# EAGLE design BatteryBalancer_SP20 (EAGLE 9.5.2)

## Sheet 1 of 5: Connectors
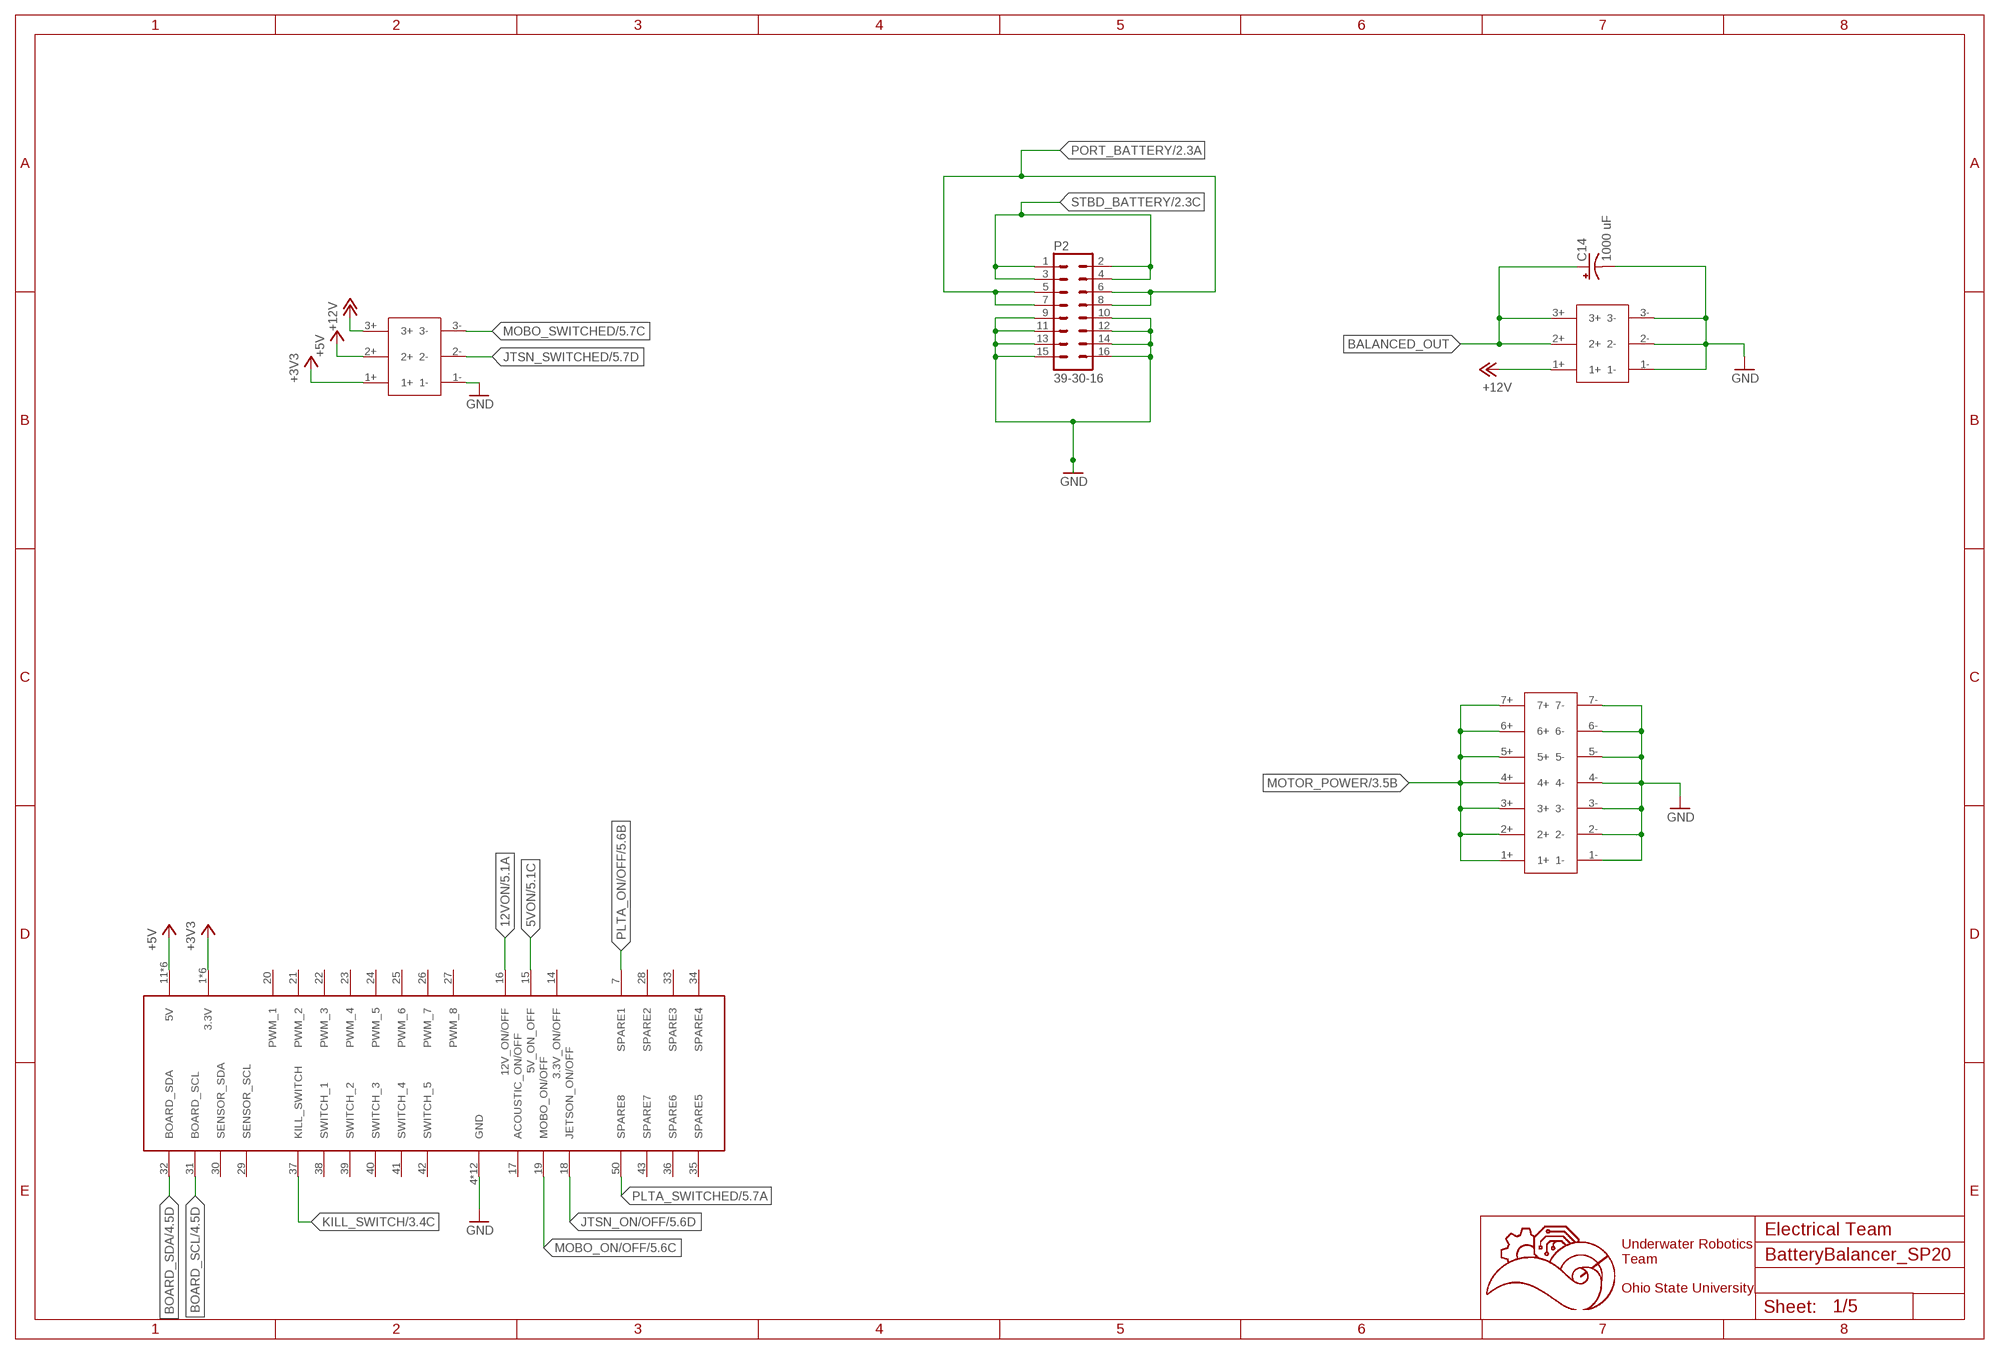
[diagram p0: schematic, sheet 1]

### Parts
C14  1000 uF  CPOL-USE5-13  [E5-13]
P2  39-30-16  [39-30-?16?]
U$1  5530843-EDGE  [5530843-6-BOARDFINGERS]
U$4  14PIN-VERT  [14PIN_VERT]
U$5  6PIN-VERT  [6PIN_VERT]
U$13  6PIN-VERT  [6PIN_VERT]

### Nets
5VON: U$1.15(5V_ON_OFF) ; also sheet 5
12VON: U$1.16(12V_ON/OFF) ; also sheet 5
+3V3: U$1.1(3.3V) U$1.2(3.3V) U$1.3(3.3V) U$1.54(3.3V) U$1.55(3.3V) U$1.56(3.3V) U$5.1+ ; also sheet 2,3,4,5
+5V: U$1.11(5V) U$1.12(5V) U$1.13(5V) U$1.44(5V) U$1.45(5V) U$1.46(5V) U$5.2+ ; also sheet 4,5
+12V: U$5.3+ U$13.1+ ; also sheet 4,5
BALANCED_OUT: C14.+ U$13.2+ U$13.3+ ; also sheet 2,3,4,5
BOARD_SCL: U$1.31(BOARD_SCL) ; also sheet 4
BOARD_SDA: U$1.32(BOARD_SDA) ; also sheet 4
GND: C14.- P2.9 P2.10 P2.11 P2.12 P2.13 P2.14 P2.15 P2.16 U$1.4(GND) U$1.5(GND) U$1.6(GND) U$1.8(GND) U$1.9(GND) U$1.10(GND) U$1.47(GND) U$1.48(GND) U$1.49(GND) U$1.51(GND) U$1.52(GND) U$1.53(GND) U$4.1- U$4.2- U$4.3- U$4.4- U$4.5- U$4.6- U$4.7- U$5.1- U$13.1- U$13.2- U$13.3- ; also sheet 2,4,5
JTSN_ON/OFF: U$1.18(JETSON_ON/OFF) ; also sheet 5
JTSN_SWITCHED: U$5.2- ; also sheet 5
KILL_SWITCH: U$1.37(KILL_SWITCH) ; also sheet 3
MOBO_ON/OFF: U$1.19(MOBO_ON/OFF) ; also sheet 5
MOBO_SWITCHED: U$5.3- ; also sheet 5
MOTOR_POWER: U$4.1+ U$4.2+ U$4.3+ U$4.4+ U$4.5+ U$4.6+ U$4.7+ ; also sheet 3
PLTA_ON/OFF: U$1.7(SPARE1) ; also sheet 5
PLTA_SWITCHED: U$1.50(SPARE8) ; also sheet 5
PORT_BATTERY: P2.5 P2.6 P2.7 P2.8 ; also sheet 2,4
STBD_BATTERY: P2.1 P2.2 P2.3 P2.4 ; also sheet 2,4
Unconnected: U$1.14(3.3V_ON/OFF) U$1.17(ACOUSTIC_ON/OFF) U$1.20(PWM_1) U$1.21(PWM_2) U$1.22(PWM_3) U$1.23(PWM_4) U$1.24(PWM_5) U$1.25(PWM_6) U$1.26(PWM_7) U$1.27(PWM_8) U$1.28(SPARE2) U$1.29(SENSOR_SCL) U$1.30(SENSOR_SDA) U$1.33(SPARE3) U$1.34(SPARE4) U$1.35(SPARE5) U$1.36(SPARE6) U$1.38(SWITCH_1) U$1.39(SWITCH_2) U$1.40(SWITCH_3) U$1.41(SWITCH_4) U$1.42(SWITCH_5) U$1.43(SPARE7)

### Notes on the sheet
- Electrical Team
- Underwater Robotics
  Team
  
  Ohio State University

## Sheet 2 of 5
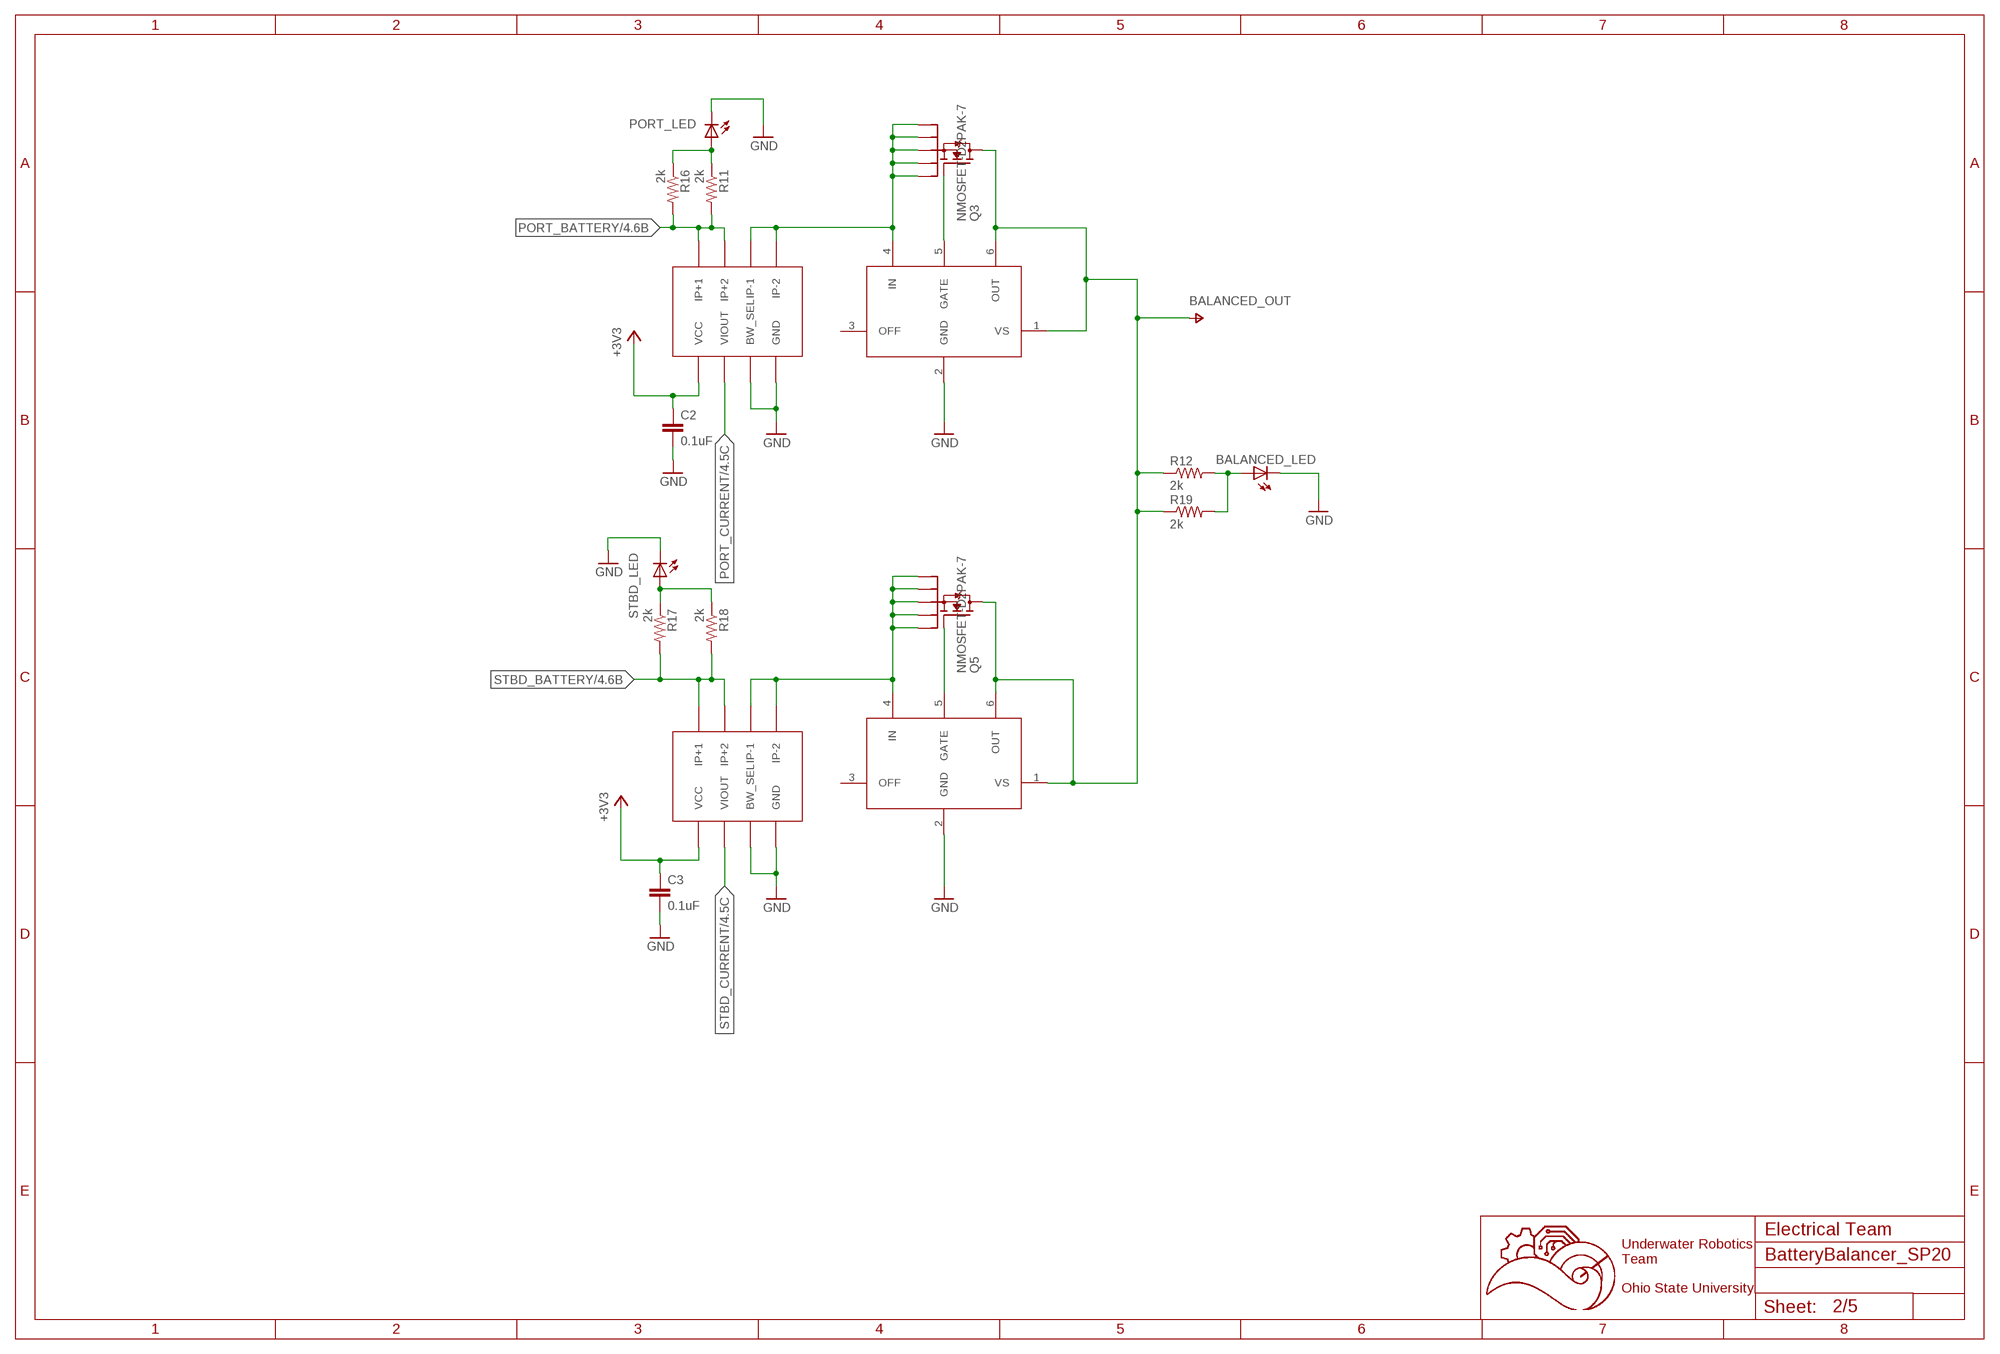
[diagram p1: schematic, sheet 2]

### Parts
BALANCED_LED  LEDCHIP-LED0603  [CHIP-LED0603]
C2  0.1uF  C-EUC0603  [C0603]
C3  0.1uF  C-EUC0603  [C0603]
PORT_LED  LEDCHIP-LED0603  [CHIP-LED0603]
Q3  NMOSFET-D2PAK-7  [D2PAK-7]
Q5  NMOSFET-D2PAK-7  [D2PAK-7]
R11  2k  R-US_R0603  [R0603]
R12  2k  R-US_R0603  [R0603]
R16  2k  R-US_R0603  [R0603]
R17  2k  R-US_R0603  [R0603]
R18  2k  R-US_R0603  [R0603]
R19  2k  R-US_R0603  [R0603]
STBD_LED  LEDCHIP-LED0603  [CHIP-LED0603]
U$2  LM5050  [LM5050]
U$3  LM5050  [LM5050]
U$6  ACS722  [SOIC-8]
U$7  ACS722  [SOIC-8]

### Nets
+3V3: C2.1 C3.1 U$6.VCC U$7.VCC ; also sheet 1,3,4,5
BALANCED_OUT: Q3.D Q5.D R12.1 R19.1 U$2.1(VS) U$2.6(OUT) U$3.1(VS) U$3.6(OUT) ; supply symbol labelled V+ ; also sheet 1,3,4,5
GND: BALANCED_LED.C C2.2 C3.2 PORT_LED.C STBD_LED.C U$2.2(GND) U$3.2(GND) U$6.BW_SEL U$6.GND U$7.BW_SEL U$7.GND ; also sheet 1,4,5
N$1: Q3.S1 Q3.S2 Q3.S3 Q3.S4 Q3.S5 U$2.4(IN) U$6.IP-1 U$6.IP-2
N$2: Q3.G U$2.5(GATE)
N$5: Q5.G U$3.5(GATE)
N$11: PORT_LED.A R11.1 R16.1
N$12: R17.1 R18.1 STBD_LED.A
N$13: BALANCED_LED.A R12.2 R19.2
PORT_BATTERY: R11.2 R16.2 U$6.IP+1 U$6.IP+2 ; also sheet 1,4
PORT_CURRENT: U$6.VIOUT ; also sheet 4
SOURCE: Q5.S1 Q5.S2 Q5.S3 Q5.S4 Q5.S5 U$3.4(IN) U$7.IP-1 U$7.IP-2
STBD_BATTERY: R17.2 R18.2 U$7.IP+1 U$7.IP+2 ; also sheet 1,4
STBD_CURRENT: U$7.VIOUT ; also sheet 4
Unconnected: U$2.3(OFF) U$3.3(OFF)

### Notes on the sheet
- Electrical Team
- Underwater Robotics
  Team
  
  Ohio State University

## Sheet 3 of 5
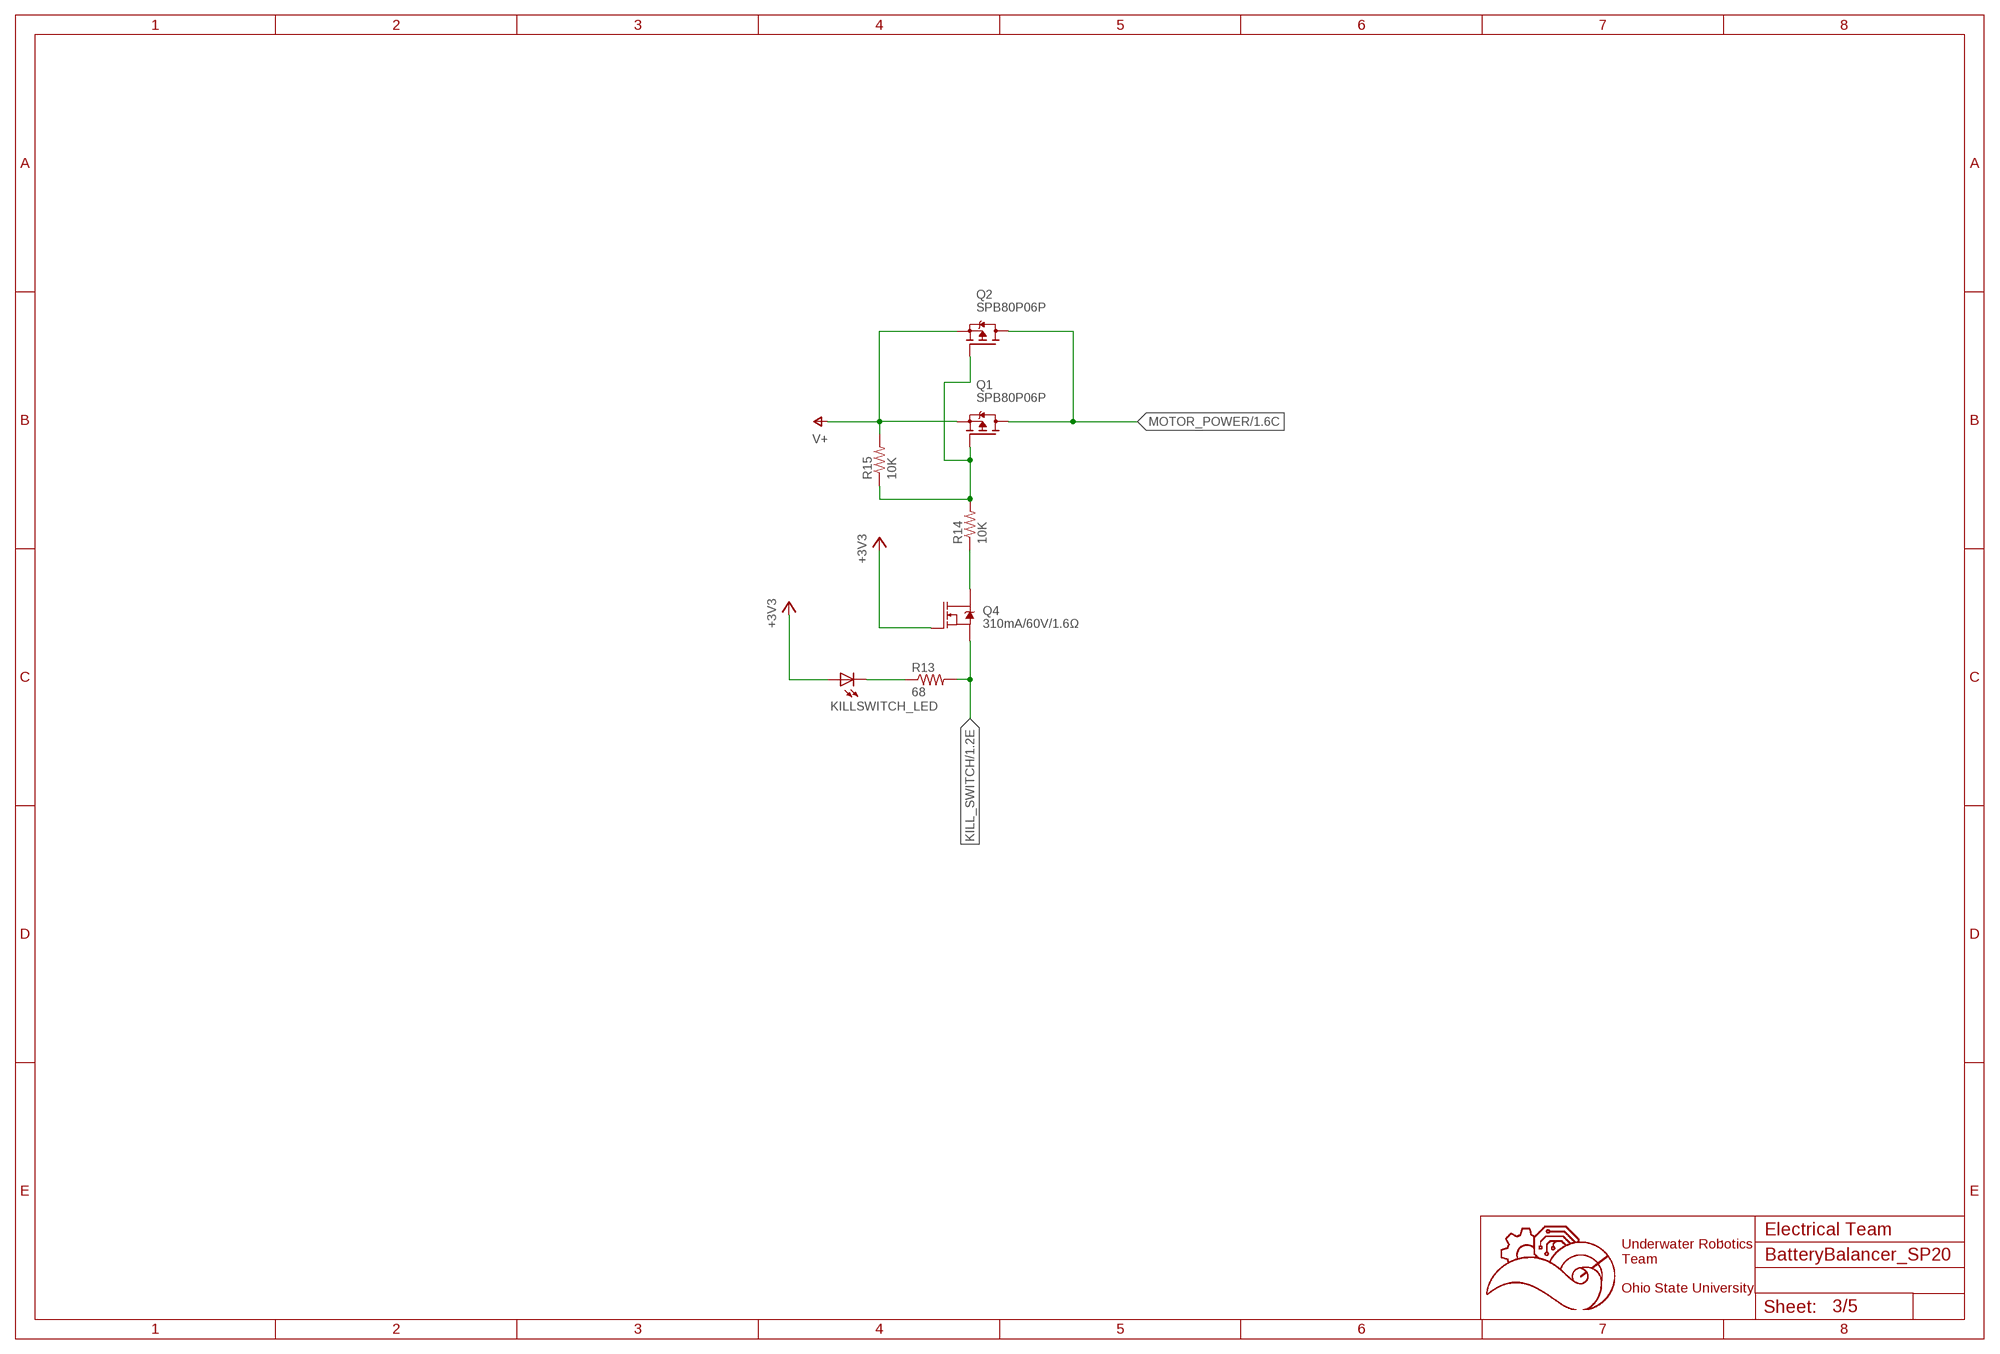
[diagram p2: schematic, sheet 3]

### Parts
KILLSWITCH_LED  LEDCHIP-LED0603  [CHIP-LED0603]
Q1  SPB80P06P  [TO263]
Q2  SPB80P06P  [TO263]
Q4  310mA/60V/1.6Ω  MOSFET-NCH-2N7002PW  [SOT323]
R13  68  R-US_R0603  [R0603]
R14  10K  R-US_R0603  [R0603]
R15  10K  R-US_R0603  [R0603]

### Nets
+3V3: KILLSWITCH_LED.A Q4.1(G) ; also sheet 1,2,4,5
BALANCED_OUT: Q1.2(S) Q2.2(S) R15.2 ; supply symbol labelled V+ ; also sheet 1,2,4,5
KILL_SWITCH: Q4.2(S) R13.2 ; also sheet 1
MOTOR_POWER: Q1.3(D) Q2.3(D) ; also sheet 1
N$4: Q4.3(D) R14.1
N$8: Q1.1(G) Q2.1(G) R14.2 R15.1
N$16: KILLSWITCH_LED.C R13.1

### Notes on the sheet
- Electrical Team
- Underwater Robotics
  Team
  
  Ohio State University

## Sheet 4 of 5
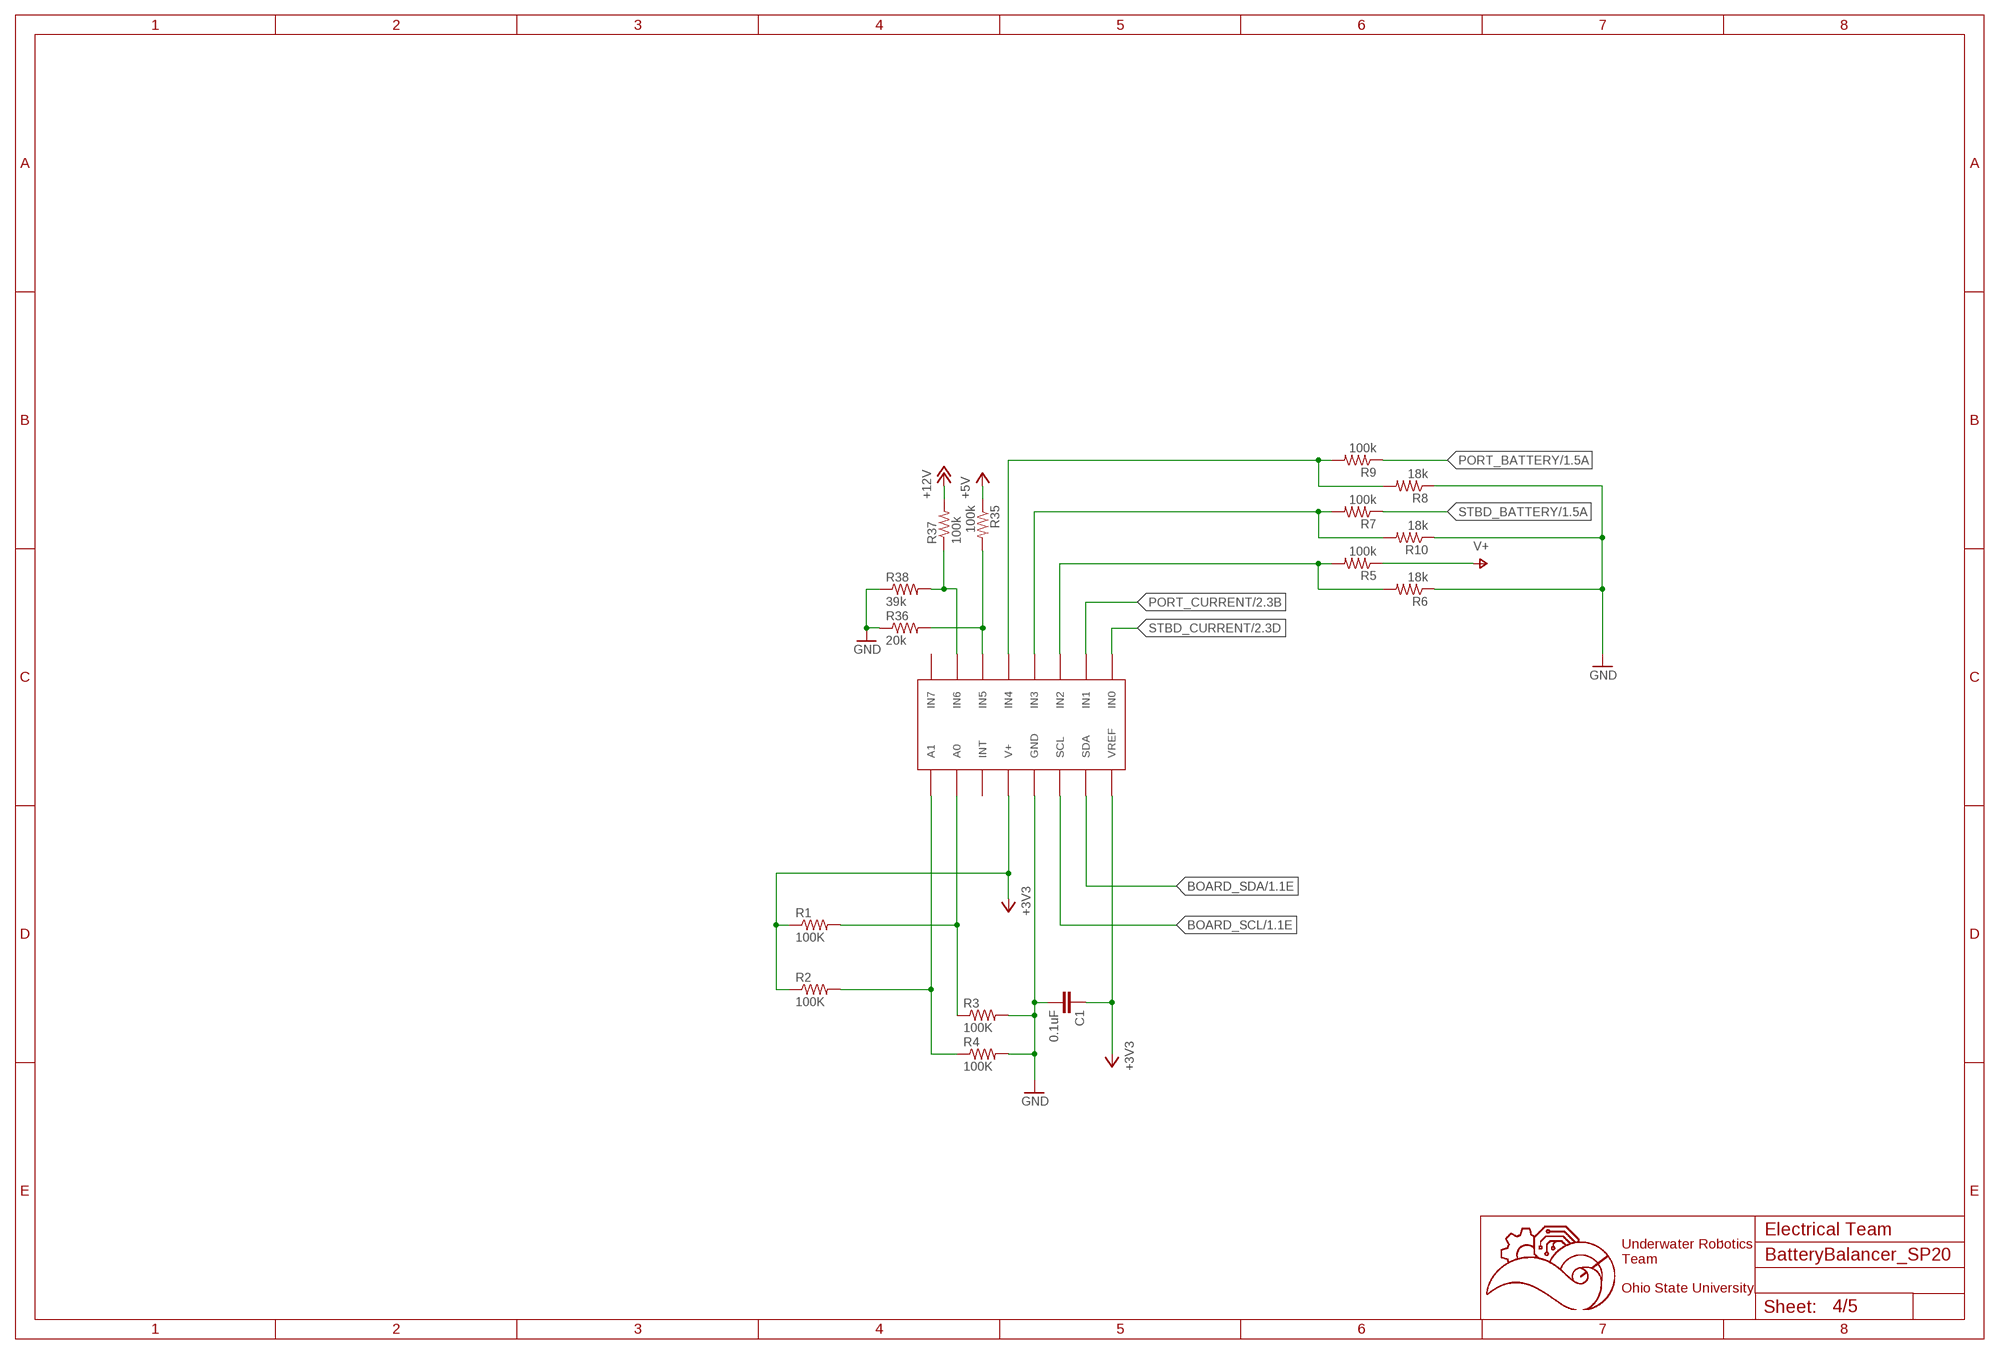
[diagram p3: schematic, sheet 4]

### Parts
C1  0.1uF  C-EUC0603  [C0603]
R1  100K  R-US_R0603  [R0603]
R2  100K  R-US_R0603  [R0603]
R3  100K  R-US_R0603  [R0603]
R4  100K  R-US_R0603  [R0603]
R5  100k  R-US_R0603  [R0603]
R6  18k  R-US_R0603  [R0603]
R7  100k  R-US_R0603  [R0603]
R8  18k  R-US_R0603  [R0603]
R9  100k  R-US_R0603  [R0603]
R10  18k  R-US_R0603  [R0603]
R35  100k  R-US_R0603  [R0603]
R36  20k  R-US_R0603  [R0603]
R37  100k  R-US_R0603  [R0603]
R38  39k  R-US_R0603  [R0603]
U$12  ADC128D818  [TSSOP-16]

### Nets
+3V3: C1.1 R1.1 R2.1 U$12.V+ U$12.VREF ; also sheet 1,2,3,5
+5V: R35.1 ; also sheet 1,5
+12V: R37.2 ; also sheet 1,5
BALANCED_OUT: R5.1 ; supply symbol labelled V+ ; also sheet 1,2,3,5
BOARD_SCL: U$12.SCL ; also sheet 1
BOARD_SDA: U$12.SDA ; also sheet 1
GND: C1.2 R3.2 R4.2 R6.1 R8.1 R10.1 R36.1 R38.1 U$12.GND ; also sheet 1,2,5
N$6: R2.2 R4.1 U$12.A1
N$7: R1.2 R3.1 U$12.A0
N$9: R7.2 R10.2 U$12.IN3
N$10: R8.2 R9.2 U$12.IN4
N$15: R5.2 R6.2 U$12.IN2
N$31: R37.1 R38.2 U$12.IN6
N$32: R35.2 R36.2 U$12.IN5
PORT_BATTERY: R9.1 ; also sheet 1,2
PORT_CURRENT: U$12.IN1 ; also sheet 2
STBD_BATTERY: R7.1 ; also sheet 1,2
STBD_CURRENT: U$12.IN0 ; also sheet 2
Unconnected: U$12.IN7 U$12.INT

### Notes on the sheet
- Electrical Team
- Underwater Robotics
  Team
  
  Ohio State University

## Sheet 5 of 5
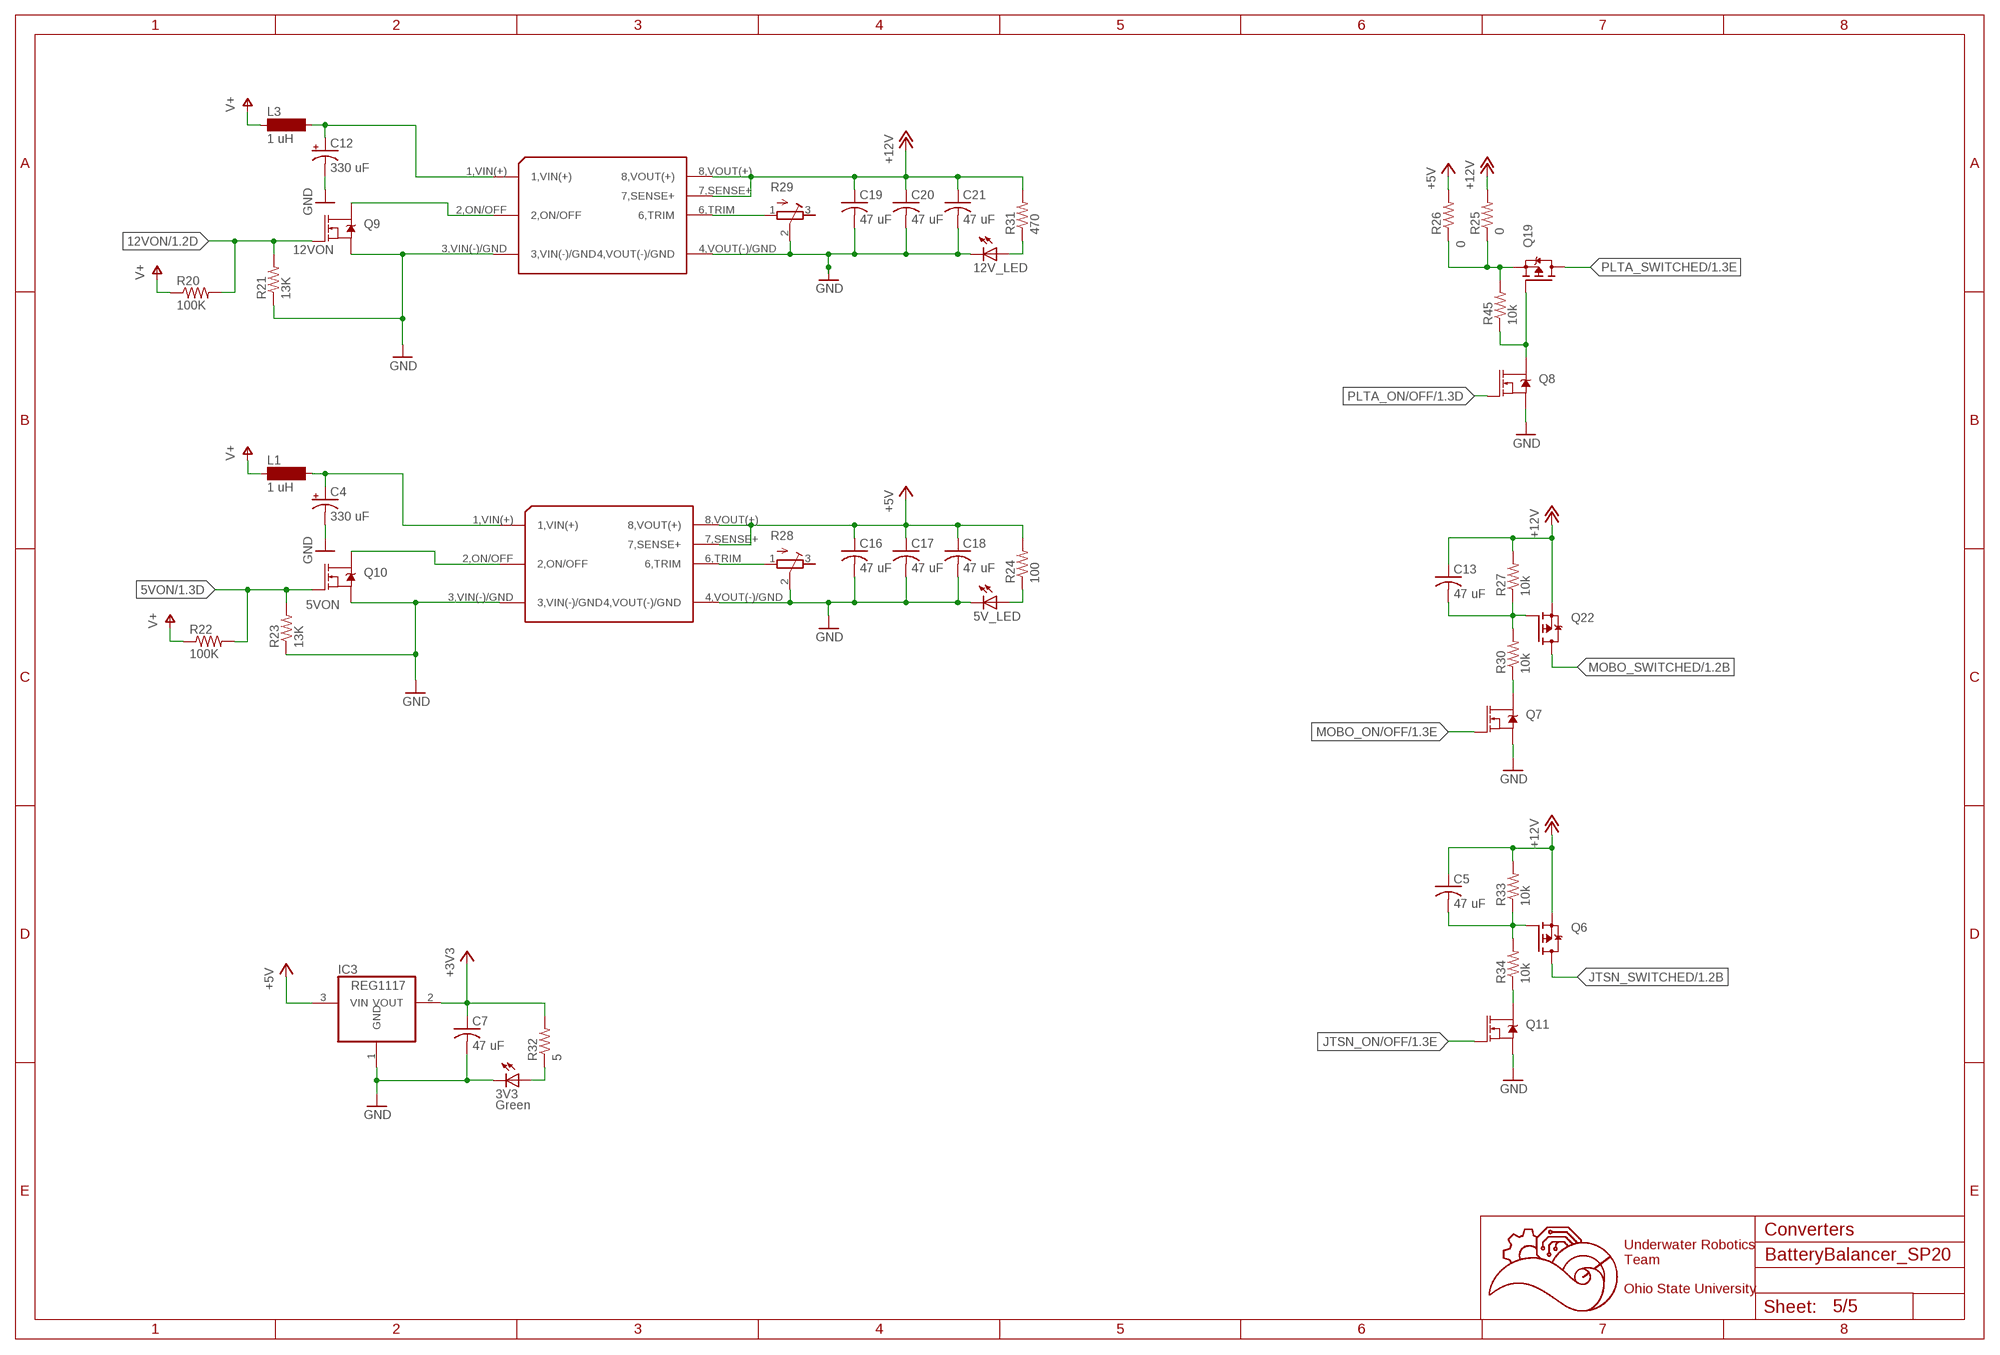
[diagram p4: schematic, sheet 5]

### Parts
3V3  Green  LEDCHIPLED_0603  [CHIPLED_0603]
5V_LED  LEDCHIPLED_0603  [CHIPLED_0603]
5VCONVERTER  CONVERTER  [CONVERTER]
12V_LED  LEDCHIPLED_0603  [CHIPLED_0603]
12VCONVERTER  CONVERTER  [CONVERTER]
C4  330 uF  CPOL-USE5-10.5  [E5-10,5]
C5  47 uF  C-USC1206K  [C1206K]
C7  47 uF  C-USC1206K  [C1206K]
C12  330 uF  CPOL-USE5-10.5  [E5-10,5]
C13  47 uF  C-USC1206K  [C1206K]
C16  47 uF  C-USC1206K  [C1206K]
C17  47 uF  C-USC1206K  [C1206K]
C18  47 uF  C-USC1206K  [C1206K]
C19  47 uF  C-USC1206K  [C1206K]
C20  47 uF  C-USC1206K  [C1206K]
C21  47 uF  C-USC1206K  [C1206K]
IC3  REG1117  [SOT223]
L1  1 uH  MS85  [MS85]
L3  1 uH  MS85  [MS85]
Q6  FDD4141TO252  [TO252]
Q7  MOSFET-NCH-AO3404A  [SOT23-3]
Q8  MOSFET-NCH-AO3404A  [SOT23-3]
Q9  MOSFET-NCH-AO3404A  [SOT23-3]
Q10  MOSFET-NCH-AO3404A  [SOT23-3]
Q11  MOSFET-NCH-AO3404A  [SOT23-3]
Q19  FDD4141TO252  [TO252]
Q22  FDD4141TO252  [TO252]
R20  100K  R-US_R0603  [R0603]
R21  13K  R-US_R0603  [R0603]
R22  100K  R-US_R0603  [R0603]
R23  13K  R-US_R0603  [R0603]
R24  100  R-US_R0603  [R0603]
R25  0  R-US_M2309  [M2309]
R26  0  R-US_M2309  [M2309]
R27  10k  R-US_R0603  [R0603]
R28  R-TRIMM3103  [RTRIM3103]
R29  R-TRIMM3103  [RTRIM3103]
R30  10k  R-US_R0603  [R0603]
R31  470  R-US_R0603  [R0603]
R32  5  R-US_R0603  [R0603]
R33  10k  R-US_R0603  [R0603]
R34  10k  R-US_R0603  [R0603]
R45  10k  R-US_R0603  [R0603]

### Nets
5VON: Q10.1(G) R22.2 R23.2 ; also sheet 1
12VON: Q9.1(G) R20.2 R21.2 ; also sheet 1
+3V3: C7.1 IC3.2(VOUT) R32.2 ; also sheet 1,2,3,4
+5V: 5VCONVERTER.7,SENSE+ 5VCONVERTER.8,VOUT(+) C16.1 C17.1 C18.1 IC3.3(VIN) R24.2 R26.2 ; also sheet 1,4
+12V: 12VCONVERTER.7,SENSE+ 12VCONVERTER.8,VOUT(+) C5.1 C13.1 C19.1 C20.1 C21.1 Q6.2(S) Q22.2(S) R25.2 R27.2 R31.2 R33.2 ; also sheet 1,4
BALANCED_OUT: L1.1 L3.1 R20.1 R22.1 ; supply symbol labelled V+ ; also sheet 1,2,3,4
GND: 3V3.C 5V_LED.C 5VCONVERTER.3,VIN(-)/GND 5VCONVERTER.4,VOUT(-)/GND 12V_LED.C 12VCONVERTER.3,VIN(-)/GND 12VCONVERTER.4,VOUT(-)/GND C4.- C7.2 C12.- C16.2 C17.2 C18.2 C19.2 C20.2 C21.2 IC3.1(GND) Q7.2(S) Q8.2(S) Q9.2(S) Q10.2(S) Q11.2(S) R21.1 R23.1 R28.2(S) R29.2(S) ; also sheet 1,2,4
JTSN_ON/OFF: Q11.1(G) ; also sheet 1
JTSN_SWITCHED: Q6.3(D) ; also sheet 1
MOBO_ON/OFF: Q7.1(G) ; also sheet 1
MOBO_SWITCHED: Q22.3(D) ; also sheet 1
N$3: 12VCONVERTER.6,TRIM R29.1(A)
N$14: 5VCONVERTER.6,TRIM R28.1(A)
N$17: C13.2 Q22.1(G) R27.1 R30.2
N$18: 12VCONVERTER.2,ON/OFF Q9.3(D)
N$19: 5VCONVERTER.2,ON/OFF Q10.3(D)
N$20: Q7.3(D) R30.1
N$21: Q19.2(S) R25.1 R26.1 R45.2
N$22: Q8.3(D) Q19.1(G) R45.1
N$23: 12VCONVERTER.1,VIN(+) C12.+ L3.2
N$24: 5VCONVERTER.1,VIN(+) C4.+ L1.2
N$25: 5V_LED.A R24.1
N$26: C5.2 Q6.1(G) R33.1 R34.2
N$27: 12V_LED.A R31.1
N$28: 3V3.A R32.1
N$29: Q11.3(D) R34.1
PLTA_ON/OFF: Q8.1(G) ; also sheet 1
PLTA_SWITCHED: Q19.3(D) ; also sheet 1
Unconnected: R28.3(E) R29.3(E)

### Notes on the sheet
- Converters
- Underwater Robotics
  Team
  
  Ohio State University
- C:/Users/blain/Downloads/Black and White.bmp

## Library data of the parts
3V3 5V_LED 12V_LED BALANCED_LED KILLSWITCH_LED PORT_LED STBD_LED = led:LED: LED OSRAM: - CHIPLED LG R971, LG N971, LY N971, LG Q971, LY Q971, LO R971, LY R971 LH N974, LH R974 LS Q976, LO Q976, LY Q976 LO Q996 - Hyper CHIPLED LW Q18S LB Q993, LB Q99A, LB R99A - SideLED LS A670, LO A670, LY A670, LG A670, LP A670 LB A673, LV A673, LT A673, LW A673 LH A674 LY A675 LS A676, LA A676, LO A676, LY A676, LW A676 LS A679, LY A679, LG A679 - Hyper Micro SIDELED® LS Y876, LA Y876, LO Y876, LY Y876 LT Y87S - SmartLED LW L88C, LW L88S LB L89C, LB L89S, LG L890 LS L89K, LO L89K, LY L89K LS L896, LA L896, LO L896, LY L896 - TOPLED LS T670, LO T670, LY T670, LG T670, LP T670 LSG T670, LSP T670, LSY T670, LOP T670, LYG T670 LG T671, LOG T671, LSG T671 LB T673, LV T673, LT T673, LW T673 LH T674 LS T676, LA T676, LO T676, LY T676, LB T676, LH T676, LSB T676, LW T676 LB T67C, LV T67C, LT T67C, LS T67K, LO T67K, LY T67K, LW E67C LS E67B, LA E67B, LO E67B, LY E67B, LB E67C, LV E67C, LT E67C LW T67C LS T679, LY T679, LG T679 LS T770, LO T770, LY T770, LG T770, LP T770 LB T773, LV T773, LT T773, LW T773 LH T774 LS E675, LA E675, LY E675, LS T675 LS T776, LA T776, LO T776, LY T776, LB T776 LHGB T686 LT T68C, LB T68C - Hyper Mini TOPLED® LB M676 - Mini TOPLED Santana® LG M470 LS M47K, LO M47K, LY M47K Source: http://www.osram.convergy.de LUXEON: - LUMILED® LXK2-PW12-R00, LXK2-PW12-S00, LXK2-PW14-U00, LXK2-PW14-V00 LXK2-PM12-R00, LXK2-PM12-S00, LXK2-PM14-U00 LXK2-PE12-Q00, LXK2-PE12-R00, LXK2-PE12-S00, LXK2-PE14-T00, LXK2-PE14-U00 LXK2-PB12-K00, LXK2-PB12-L00, LXK2-PB12-M00, LXK2-PB14-N00, LXK2-PB14-P00, LXK2-PB14-Q00 LXK2-PR12-L00, LXK2-PR12-M00, LXK2-PR14-Q00, LXK2-PR14-R00 LXK2-PD12-Q00, LXK2-PD12-R00, LXK2-PD12-S00 LXK2-PH12-R00, LXK2-PH12-S00 LXK2-PL12-P00, LXK2-PL12-Q00, LXK2-PL12-R00 Source: www.luxeon.com KINGBRIGHT: KA-3528ASYC Source: www.kingbright.com
5VCONVERTER 12VCONVERTER = converter:CONVERTER
C1-C3 = rcl:C-EU: CAPACITOR, European symbol; SPICEPREFIX: C
C4 C12 C14 = rcl:CPOL-US: POLARIZED CAPACITOR, American symbol; SPICEPREFIX: C
C5 C7 C13 C16-C21 = resistor:C-US: CAPACITOR, American symbol
IC3 = burr-brown:REG1117: 800mA and 1A Low Dropout (LDO) Positive Regulator 1.8V, 2.5V, 2.85V, 3.3V, 5V, and Adj; MPN: REG1117; OC_FARNELL: 1097566; OC_NEWARK: 14P6981
L1 L3 = inductor-neosid:MS85: INDUCTOR SMD power inductor; OC_FARNELL: unknown; OC_NEWARK: unknown
P2 = con-molex-mini-fit:39-30-?16?: HEADER
Q1 Q2 = transistor-fet:SPB80P06P: SIPMOS (R) Power-Transistor P-Channel, Enhancement mode Source: http://www.infineon.com/upload/Document/cmc_upload/documents/011/3685/SPP80P06P.pdf
Q3 Q5 = D2PAK-7:NMOSFET-D2PAK-7
Q4 = SparkFun-DiscreteSemi:MOSFET-NCH: N-channel MOSFETs Voltage controlled devices that allow control of high current outputs. SparkFun Products: SparkFun OpenScale <https://www.sparkfun.com/products/13261> SparkFun Digital Sandbox <https://www.sparkfun.com/products/12651> SparkFun Monster Moto Shield <https://www.sparkfun.com/products/10182> SparkFun MOSFET Power Controller <https://www.sparkfun.com/products/11214>; PROD_ID: TRANS-11151
Q6 Q19 Q22 = transistor-fet:FDD4141: P-Channel PowerTrench® MOSFET Source: FDD4141.pdf
Q7-Q11 = SparkFun-DiscreteSemi:MOSFET-NCH: N-channel MOSFETs Voltage controlled devices that allow control of high current outputs. SparkFun Products: SparkFun OpenScale <https://www.sparkfun.com/products/13261> SparkFun Digital Sandbox <https://www.sparkfun.com/products/12651> SparkFun Monster Moto Shield <https://www.sparkfun.com/products/10182> SparkFun MOSFET Power Controller <https://www.sparkfun.com/products/11214>; PROD_ID: TRANS-12988; VALUE: 5.8A/30V/35mΩ
R1-R24 R31 R32 R35-R38 = rcl:R-US_: RESISTOR, American symbol; SPICEPREFIX: R
R25-R27 R30 R33 R34 R45 = resistor:R-US_: RESISTOR, American symbol
R28 R29 = rcl:R-TRIMM: Trimm resistor; SPICEMODEL: X; SPICEPREFIXL: POT
U$1 = 5530843-6:5530843-EDGE
U$2 U$3 = LM5050:LM5050
U$4 = Vertical_Connectors:14PIN-VERT
U$5 U$13 = Vertical_Connectors:6PIN-VERT
U$6 U$7 = ACS722:ACS722
U$12 = ADC128D818:ADC128D818

## Board
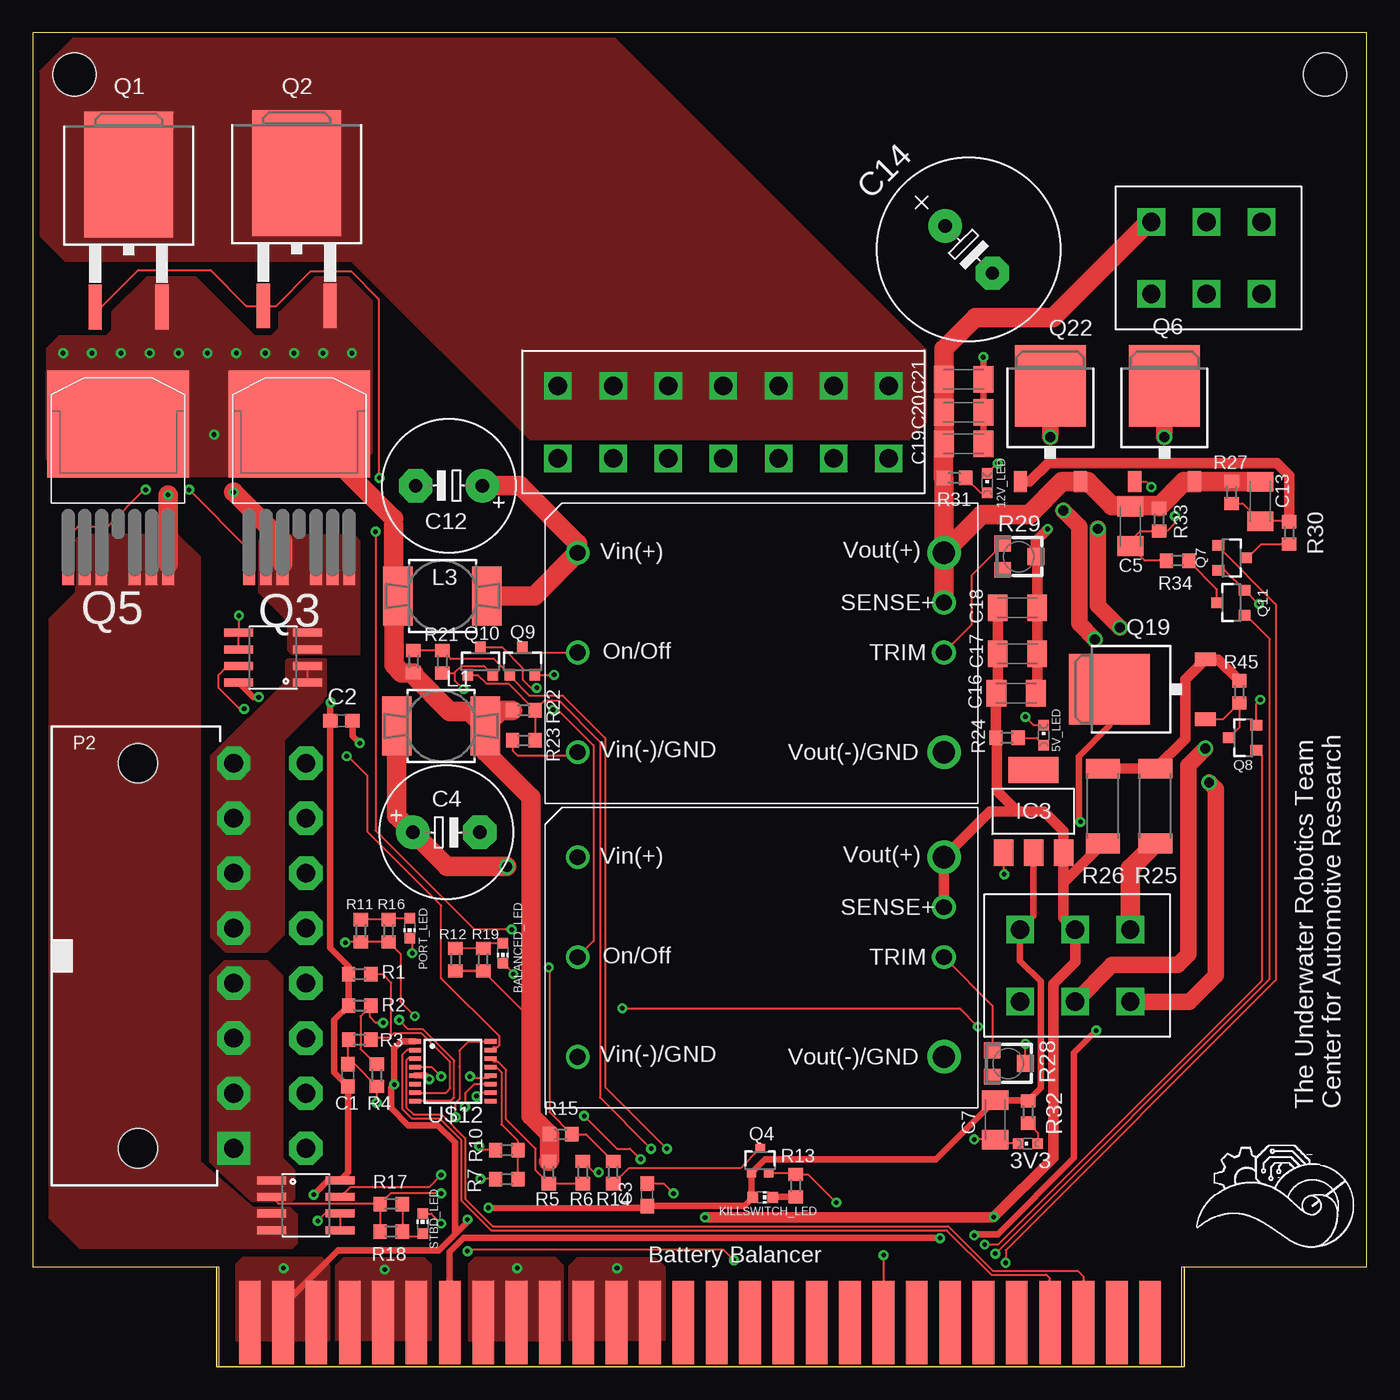
[diagram p5: board, top side]
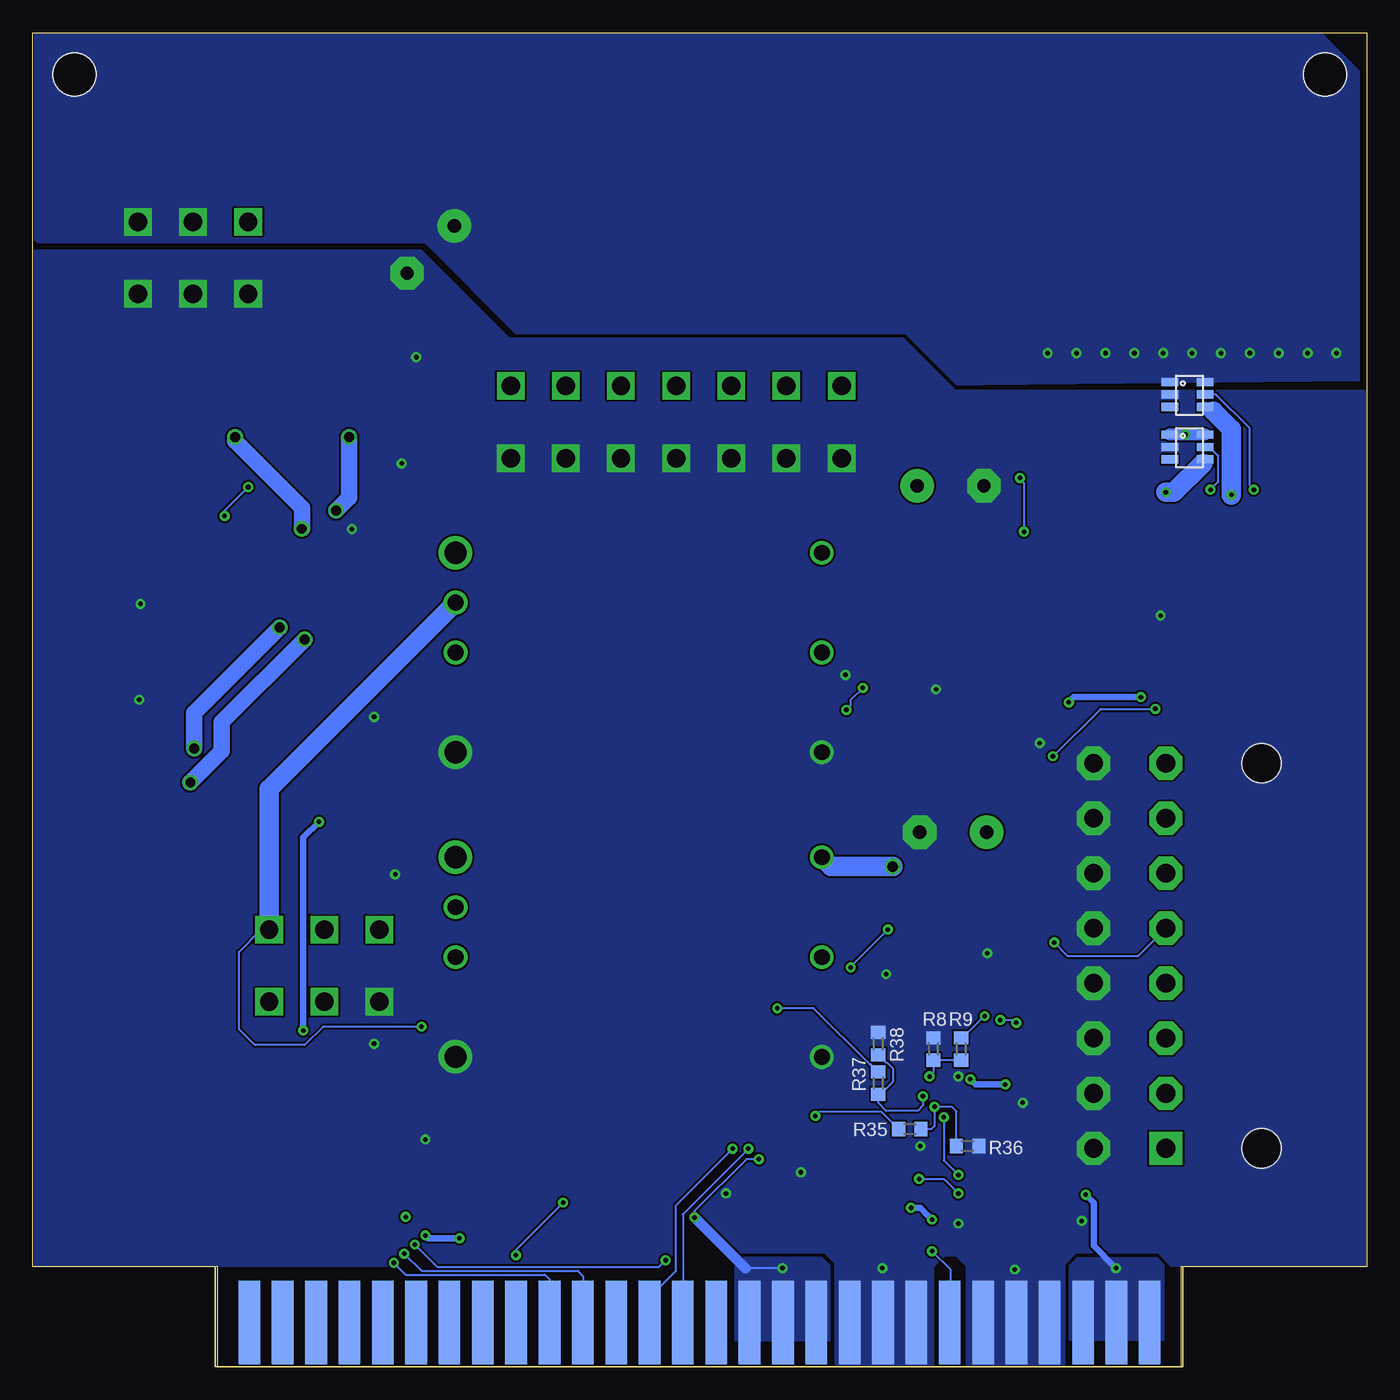
[diagram p6: board, bottom side, seen from below]

Size 101.6 x 101.6 mm. Coordinates in mm from the lower left corner, seen from the top.
Outline: 0,7.6 14.14,7.6 14.14,0 87.53,0 87.53,7.62 101.6,7.62 101.6,101.6 0,101.6 0,7.6
Copper layers (1*16): Top 0.035mm / dielectric 1.5mm / Bottom 0.035mm
Design rules "default *": minimum track width 6mil, minimum drill 0.35mm, track to track 6mil, track to pad 6mil, pad to pad 6mil, via to via 6mil, smd to smd 6mil, copper to edge 0.00508125mm, drill to drill 6mil, minimum pad ring 10mil, minimum via ring 8mil, stop-mask expansion 4mil, vias tented up to drill 0mil, thermal gap 10mil
Holes 3.26 mm at 3.17,98.42 98.42,98.42

### Footprints (pad centres in the part's own frame; a part is rotated, then mirrored left to right if it is on the bottom)
CHIPLED_0603 = smd 0.8 x 0.8: A 0,-0.75; C 0,0.75
CONVERTER = drill 1.2: 1,VIN(+) 2.5,19.1; 2,ON/OFF 2.5,11.5; 3,VIN(-)/GND 2.5,3.9; 6,TRIM 30.4,11.5; 7,SENSE+ 30.4,15.3 | drill 1.7: 4,VOUT(-)/GND 30.4,3.9; 8,VOUT(+) 30.4,19.1
CHIP-LED0603 = smd 0.8 x 0.8: A 0,-0.75; C 0,0.75
C0603 = smd 1.1 x 1: 1 -0.85,0; 2 0.85,0
E5-10,5 = drill 1.016 pad 2.54: + -2.54,0 | drill 1.016 pad 2.54 octagon: - 2.54,0
C1206K = smd 1.5 x 2: 1 -1.5,0; 2 1.5,0
E5-13 = drill 1.016 pad 2.54: + -2.54,0 | drill 1.016 pad 2.54 octagon: - 2.54,0
SOT223 = smd 1.499 x 2.007: 1 -2.261,-3.15; 2 0.025,-3.15; 3 2.311,-3.15 | smd 3.81 x 2.007: 4 0,3.15
MS85 = smd 4.5 x 2.25: 1 0,-3.383; 2 0,3.383
39-30-?16? = drill 1.422 pad 2.54 square: 1 14.668,0 | drill 1.422 pad 2.54 octagon: 2 10.477,0; 3 6.287,0; 4 2.095,0; 5 -2.095,0; 6 -6.287,0; 7 -10.477,0; 8 -14.668,0; 9 14.668,5.512; 10 10.477,5.512; 11 6.287,5.512; 12 2.095,5.512; 13 -2.095,5.512; 14 -6.287,5.512; 15 -10.477,5.512; 16 -14.668,5.512 | hole 3: -14.668,-7.3; 14.668,-7.3
TO263 = smd 1 x 3.4: 1 -2.54,-6.6; 2 2.54,-6.6 | smd 6.8 x 9.6: 3 0,3.5
D2PAK-7 = smd 10.8 x 8.15: D 0,4.1 | smd 0.9 x 3.2: G -3.81,-6.56; S1 -2.54,-6.56; S2 -1.27,-6.56; S3 1.27,-6.56; S4 2.54,-6.56; S5 3.81,-6.56
SOT323 = smd 0.7 x 0.7: 1 -0.65,-0.925; 2 0.65,-0.925; 3 0,0.925
TO252 = smd 1 x 1.6: 1 -2.28,-4.8; 2 2.28,-4.8 | smd 5.4 x 6.2: 3 0,2.5
SOT23-3 = smd 0.8 x 0.9: 1 -0.95,-1; 2 0.95,-1; 3 0,1.1
R0603 = smd 1 x 1.1: 1 -0.85,0; 2 0.85,0
M2309 = smd 1.5 x 2.6: 1 -2.85,0; 2 2.85,0
RTRIM3103 = smd 1.2 x 1.25: 1 -1,-1.225; 3 1,-1.225 | smd 1.3 x 1.3: 2 0,1.3
5530843-6-BOARDFINGERS = smd 1.651 x 6.35 bottom: 1 0.826,3.375; 2 3.365,3.375; 3 5.905,3.375; 4 8.445,3.375; 5 10.986,3.375; 6 13.525,3.375; 7 16.066,3.375; 8 18.605,3.375; 9 21.145,3.375; 10 23.686,3.375; 11 26.226,3.375; 12 28.765,3.375; 13 31.305,3.375; 14 33.846,3.375; 15 36.386,3.375; 16 38.925,3.375; 17 41.465,3.375; 18 44.005,3.375; 19 46.545,3.375; 20 49.086,3.375; 21 51.626,3.375; 22 54.166,3.375; 23 56.706,3.375; 24 59.245,3.375; 25 61.785,3.375; 26 64.326,3.375; 27 66.865,3.375; 28 69.406,3.375 | smd 1.651 x 6.35: 29 69.406,3.375; 30 66.865,3.375; 31 64.326,3.375; 32 61.785,3.375; 33 59.245,3.375; 34 56.706,3.375; 35 54.166,3.375; 36 51.626,3.375; 37 49.086,3.375; 38 46.545,3.375; 39 44.005,3.375; 40 41.465,3.375; 41 38.925,3.375; 42 36.386,3.375; 43 33.846,3.375; 44 31.305,3.375; 45 28.765,3.375; 46 26.226,3.375; 47 23.686,3.375; 48 21.145,3.375; 49 18.605,3.375; 50 16.066,3.375; 51 13.525,3.375; 52 10.986,3.375; 53 8.445,3.375; 54 5.905,3.375; 55 3.365,3.375; 56 0.826,3.375
LM5050 = smd 0.635 x 1.27: 1 0,0; 2 0.95,0; 3 1.9,0; 4 1.9,2.7; 5 0.95,2.7; 6 0,2.7
14PIN_VERT = drill 1.4 square: 1+ 0,0; 1- 5.5,0; 2+ 0,4.2; 2- 5.5,4.2; 3+ 0,8.4; 3- 5.5,8.4; 4+ 0,12.6; 4- 5.5,12.6; 5+ 0,16.8; 5- 5.5,16.8; 6+ 0,21; 6- 5.5,21; 7+ 0,25.2; 7- 5.5,25.2
6PIN_VERT = drill 1.4 square: 1+ 0,0; 1- 5.5,0; 2+ 0,4.2; 2- 5.5,4.2; 3+ 0,8.4; 3- 5.5,8.4
SOIC-8 = smd 0.61 x 2.21: BW_SEL 0.635,2.616; GND 1.905,2.616; IP+1 -1.905,-2.616; IP+2 -0.635,-2.616; IP-1 0.635,-2.616; IP-2 1.905,-2.616; VCC -1.905,2.616; VIOUT -0.635,2.616
TSSOP-16 = smd 0.9 x 0.35: A0 -2.875,-1.625; A1 -2.875,-2.275; GND -2.875,0.325; IN0 2.875,2.275; IN1 2.875,1.625; IN2 2.875,0.975; IN3 2.875,0.325; IN4 2.875,-0.325; IN5 2.875,-0.975; IN6 2.875,-1.625; IN7 2.875,-2.275; INT -2.875,-0.975; SCL -2.875,0.975; SDA -2.875,1.625; V+ -2.875,-0.325; VREF -2.875,2.275

### Placement (x,y rotation side)
3V3  75.8,17 90 top
5V_LED  77,48.1 0 top
5VCONVERTER  39,19.7 0 top
12V_LED  72.7,67.3 0 top
12VCONVERTER  39,42.9 0 top
BALANCED_LED  35.8,31.5 180 top
C1  24,22.2 90 top
C2  23.5,49.2 0 top
C3  46.8,13.1 90 top
C4  31.5,40.7 0 top
C5  83.6,64 270 top
C7  73.3,18.8 270 top
C12  31.7,67.1 180 top
C13  93.5,65.9 270 top
C14  71.29,85.09 315 top
C16  74.9,51.3 0 top
C17  75,54.3 0 top
C18  75,57.8 0 top
C19  70.9,70.3 0 top
C20  70.9,72.7 0 top
C21  70.9,75.2 0 top
IC3  76.2,42.3 0 top
KILLSWITCH_LED  55.6,12.9 270 top
L1  31.1,48.8 90 top
L3  31.2,58.7 270 top
P2  39-30-16?  [39-30-?16?]  15.3,31.3 270 top
PORT_LED  28.7,33.4 180 top
Q1  7.3,87.3 0 top
Q2  20.1,87.4 0 top
Q3  20.3,67.7 0 top
Q4  55.4,15.7 0 top
Q5  6.5,67.7 0 top
Q6  86.2,72.2 0 top
Q7  91.3,61.6 270 top
Q8  92.2,47.9 90 top
Q9  37.3,53.7 0 top
Q10  34.1,53.7 0 top
Q11  91.3,58.2 90 top
Q19  84.5,51.6 90 top
Q22  77.5,72.2 0 top
R1  24.9,29.9 0 top
R2  24.9,27.5 0 top
R3  24.9,24.9 180 top
R4  26.2,22.2 270 top
R5  39.3,14.8 270 top
R6  41.9,14.8 270 top
R7  36.1,14.3 0 top
R8  33,24.2 270 bottom
R9  30.9,24.2 270 bottom
R10  36.1,16.5 0 top
R11  25,33.2 270 top
R12  32.2,31 90 top
R13  58.1,13.8 90 top
R14  44.2,14.8 90 top
R15  40.2,17.7 180 top
R16  27.1,33.2 270 top
R17  27.3,12.4 180 top
R18  27.3,10.3 180 top
R19  34.3,31 90 top
R20  29,53.7 90 top
R21  31.2,53.7 90 top
R22  37.4,50 0 top
R23  37.4,47.7 0 top
R24  74.2,47.9 180 top
R25  85.5,42.7 270 top
R26  81.5,42.7 270 top
R27  91.3,66.6 90 top
R28  74.3,23.1 270 top
R29  75.1,61.7 270 top
R30  95.7,63.5 90 top
R31  70.2,67.7 180 top
R32  75.8,19.4 90 top
R33  85.8,64.5 90 top
R34  87.2,61.4 180 top
R35  34.8,18.1 0 bottom
R36  30.4,16.8 180 bottom
R37  37.2,21.6 90 bottom
R38  37.2,24.6 270 bottom
R45  91.9,51.4 90 top
STBD_LED  29.7,10.9 0 top
U$1  15.7,0 0 top
U$2  15,71 270 bottom
U$3  15,75 270 bottom
U$4  40,74.7 270 top
U$5  75.2,33.3 270 top
U$6  18.3,54 90 top
U$7  20.8,12.3 270 top
U$12  32,22.5 0 top
U$13  85.2,87.2 270 top

### Tracks (layer width: path | path; a pad name or v marks a point on that pad's centre or on a via)
5VON  (via drill 0.35)
  Top 0.152: R22.2 R23.2 | v47.1,16.6 43.2,20.5 43.2,47.6 40.07,50.73 38.98,50.73 R22.2 | R22.2 36.23,52.02 34.55,52.02 33.88,52.7 Q10.1
  Bottom 0.152: v47.1,16.6 52.09,11.61 U$1.15
12VON  (via drill 0.35)
  Top 0.152: R20.2 R21.2 31.85,53.9 35.15,53.9 Q9.1 36.35,52.6 37.85,51.1 40.4,51.1 43.6,47.9 43.6,21.3 v48.3,16.6
  Bottom 0.152: U$1.16 54.63,5.28 52.64,7.26 52.64,12.26 v48.3,16.6
+3V3  (via drill 0.35)
  Top 0.152: R32.2 75.75,20.3
  Top 0.5: 75.75,20.3 C7.1 68.8,15.8 55.77,15.8 Q4.1 54.75,13 KILLSWITCH_LED.A 54.2,12.25 C3.1 46.66,12.11 45.35,12.11 34.74,12.05 v34.7,12.1 | 32.15,10.08 32.15,17.07 30.82,18.4 28.6,18.4 27.3,19.7 27.3,21.27 v27.54,21.5 27.54,24.23 28.07,24.77 U$12.VREF | 32.15,10.08 30.95,8.88 23.27,8.88 19.07,4.67 U$1.2 | v33.1,11.21 33.1,11.03 32.15,10.08 | v22.7,50.6 22.65,50.55 C2.1 22.65,31.9 24.05,30.5 R1.1 R2.1 22.95,26.4 22.95,22.4 C1.1 24,14.79 U$7.VCC 22.5,14.21 v21.4,13.1 | v17.2,51 16.78,51 U$6.VCC | IC3.2 76.22,34.33 U$5.1+ 75.2,30.92 76.78,29.34 76.78,21.23 R32.2 | v30.2,21.9 29.93,22.18 U$12.V+
  Bottom 0.5: v33.1,11.21 33.4,11.51 33.41,11.51 34,12.1 v34.7,12.1 | v22.7,50.6 22.3,51 v17.2,51 | v19.1,7.51 20.79,9.2 20.79,12.49 v21.4,13.1 | v27.54,21.5 29.8,21.5 v30.2,21.9
  pour Bottom (no thermals): 15.5,2 22.6,2 22.6,7.7 22,8.3 16,8.3 15.5,7.8
  pour Top (no thermals): 15.5,2 22.6,2 22.6,7.7 22,8.3 16,8.3 15.5,7.8
+5V  (via drill 0.35)
  Top 0.152: 78.51,36.86 78.51,36.8 | 73.17,11.37 v73.2,11.4 | v42,19.1 44.5,16.6 45.5,16.6 v46.3,15.8
  Top 0.8: C18.1 C17.1 73.5,51.4 C16.1 73.4,51.02 73.35,51.07 R24.2 73.45,47.8 73.45,43.85 75,42.3 | 5VCONVERTER.7,SENSE+ 5VCONVERTER.8,VOUT(+) 72.9,42.3 75,42.3 | 75,42.3 77,42.3 78.51,40.79 IC3.3 78.51,36.8 78.51,34.19 U$5.2+ 79.4,30.82 77.72,29.14 77.72,15.92 v73.2,11.4 | R26.2 78.51,36.86 | v51.2,11.37 73.17,11.37
  Bottom 0.152: v44.5,7.5 47.33,7.5 | R35.1 36.95,19.4 41.7,19.4 v42,19.1 | v46.3,15.8 47.26,15.8 51.2,11.86 v51.2,11.37
  Bottom 0.8: 47.33,7.5 v51.2,11.37
  pour Top (no thermals): 40.9,2 40.9,7.7 41.5,8.3 47.4,8.3 48.1,7.6 48.1,2
  pour Bottom (no thermals): 40.9,2 40.9,7.7 41.5,8.3 47.4,8.3 48.1,7.6 48.1,2
+12V  (via drill 0.35)
  Top 0.152: 91.35,67.4 R27.2 | R31.2 69.4,67.65 | R33.2 85.8,65.52 | C5.1 83.7,65.6 | v72,25.9 70.6,27.3 v44.9,27.3
  Top 1.5: 85.88,65.6 87.68,67.4 Q6.2 91.35,67.4 C13.1 | 85.88,65.6 83.7,65.6 82.18,65.6 80.38,67.4 Q22.2 78.4,67.4 75.9,64.9 72.3,64.9 12VCONVERTER.8,VOUT(+) | 12VCONVERTER.7,SENSE+ 12VCONVERTER.8,VOUT(+) | R31.2 69.35,70.25 C19.1 69.4,72 69.44,71.9 69.4,71.96 C20.1 C21.1 69.4,77.5 71.8,79.9 77.7,79.9 85,87.2 U$13.1+ | 69.4,67.65 12VCONVERTER.8,VOUT(+) | 85.8,65.52 85.88,65.6 | R25.2 83.6,37.95 U$5.3+
  Bottom 0.152: R37.2 37.77,23.02 37.84,23.02 42.12,27.3 v44.9,27.3 | v72,25.9 79.5,25.9 80.9,24.5 84.7,24.5 85.9,25.7 85.9,31.6 84.2,33.3 U$5.3+
  Bottom 1.5: 12VCONVERTER.7,SENSE+ 83.6,44 U$5.3+
BALANCED_OUT  (via drill 0.35)
  Top 0.152: L1.1 34.44,48.76 | 27.5,64.1 27.5,64.6 | 37.75,26.7 37.95,26.7
  Top 0.2: R12.1 R19.1 37.75,26.7
  Top 1.5: R22.1 35.68,50 L1.1 34.48,46.83 37.95,43.36 37.95,26.7 37.95,19.1 R15.2 39.35,15.7 R5.1 | 34.44,48.76 33.28,49.92 31.75,49.92 29,52.68 R20.1 28.1,52.85 27.52,53.43 27.52,58.4 L3.1 27.5,59.02 27.5,64.1 | 27.5,64.6 Q3.D
  Bottom 0.9: U$2.6 v13.8,71 U$2.1
  other vias: 2.3,77.2 4.5,77.2 6.7,77.2 8.9,77.2 11.1,77.2 13.3,77.2 15.5,77.2 17.7,77.2 19.9,77.2 22.1,77.2 24.3,77.2
  pour Top (no thermals): 1.1,69.1 1.1,77.6 2,78.5 5.6,78.5 6.1,79 6.1,80.4 8.7,83 12.4,83 16.9,78.5 18.2,78.5 18.8,79.1 18.8,80.3 21.5,83 24,83 25.8,81.2 25.8,69.6 24,67.8 2.4,67.8
  pour Bottom (no thermals): 29.3,74.8 31.2,74.8 35.1,78.7 64.8,78.7 71.7,85.6 101.2,85.6 101.4,85.8 101.4,101.5 3.4,101.5 0.6,98.7 0.6,75.1
BOARD_SCL
  Top 0.152: U$12.SCL 28.57,23.48 28.45,23.35 28.45,19.75 29,19.2 31.12,19.2 32.93,17.4 32.93,12.8 35.03,10.71 69.73,10.71 73.13,7.3 79.59,7.3 80.03,6.88 U$1.31
BOARD_SDA
  Top 0.152: U$12.SDA 28.52,24.12 28.14,23.74 28.14,19.63 28.87,18.9 31,18.9 32.63,17.27 32.63,12.67 34.9,10.4 69.6,10.4 73,7 77.2,7 77.3,6.9 77.4,6.8 77.49,6.71 U$1.32
GND  (via drill 0.35)
  Top 0.152: U$6.BW_SEL U$6.GND 15.7,55.92 v15.7,57.2 | R21.1 32.13,52.85 32.14,52.86 | 32.14,52.86 32.66,53.38 34.37,53.38 Q10.2 | 32.14,52.86 32.14,52.26 v32.8,51.6 | Q9.2 v39.7,52.7 | R23.1 36.55,46.93 36.95,46.52 41.22,46.52 12VCONVERTER.3,VIN(-)/GND | PORT_LED.C 28.9,32.45 v28.9,31.5 | BALANCED_LED.C 36.6,29.95 v36.6,29.9 | R3.2 24,24.85 C1.2 24.5,23.05 R4.2 v26.2,20.1 | STBD_LED.C 30.35,11.65 v31.1,10.9 | R10.1 34.3,16.5 v34,16.8 | R6.1 42.75,14.8 v43.1,14.8 | R29.2 76.5,61.6 | 76.5,51.4 C16.2 | IC3.1 73.94,37.56 v74,37.5 | R28.2 v75.6,24.6 | v71.7,17.3 C7.2 73.6,17.3 73.9,17 3V3.C | Q8.2 93.2,50.5 v93.5,50.8 | 5V_LED.C 76.25,48.85 v75.6,49.5 | 12V_LED.C 73.45,68.8 v73.5,68.8 | U$7.GND U$7.BW_SEL 22.27,11.66 v21.7,11.1 | C3.2 48.05,13.95 v48.8,13.2 | v93.4,58.1 93.35,58.1 Q11.2 90.8,60.65 Q7.2 | U$12.GND 30.38,22.82 v31.11,22.1
  Top 0.5: C2.2 24.35,48.05 v24.9,47.5 | C19.2 C20.2 C21.2 v72.4,76.9
  Top 0.8: 76.5,61.6 C18.2 C17.2 76.5,51.4 | R29.2 76.4,62.9 v77.3,63.8
  other vias: 26.8,7.4 36.9,7.5
  pour Top (no thermals): 23.1,2 23.1,7.7 23.7,8.3 29.8,8.3 30.3,7.8 30.3,2
  pour Top (no thermals): 40.4,2 40.4,7.7 39.8,8.3 33.7,8.3 33.2,7.8 33.2,2
  pour Bottom (no thermals): 0.1,74.3 31.3,74.3 35.3,78.3 65.3,78.3 71.99,84.99 101.5,84.99 101.5,7.7 48.6,7.7 47.6,8.7 41.3,8.7 40.5,7.9 40.5,0.2 33,0.2 33,7.6 32.1,8.5 31.3,8.5 30.5,7.7 30.5,0.2 23,0.2 23,7.8 22.1,8.7 15.9,8.7 14.9,7.7 0.1,7.7
JTSN_ON/OFF  (via drill 0.35)
  Top 0.152: Q11.1 92.4,57.25 94.2,55.45 94.2,29.5 v73.31,8.61
  Bottom 0.152: U$1.18 59.69,3.39 59.69,5.4 59.69,6.2 59.69,6.89 60.1,7.3 72,7.3 v73.31,8.61
JTSN_SWITCHED  (via drill 0.75 pad 1)
  Top 1.27: U$5.2- 82.2,30.6 87.2,30.6 88,31.4 88,45.8 v89.3,47.1 | v82.8,56.3 81.12,57.98 v81.12,63.82 | v86.2,70.8 Q6.3
  Bottom 1.27: v89.3,47.1 89.3,49.8 v82.8,56.3 | v81.12,63.82 81.1,63.84 81.1,65.4 86.2,70.5 v86.2,70.8
KILL_SWITCH  (via drill 0.35)
  Top 0.152: Q4.2 57.95,14.78 58.08,14.65 R13.2 59.05,14.65 v61.2,12.5 | v64.8,8.5 U$1.37
  Bottom 0.152: v64.8,8.5 64.8,8.9 v61.2,12.5
MOBO_ON/OFF  (via drill 0.35)
  Top 0.152: Q7.1 90.3,62.45 94.68,58.07 94.68,29.45 74.1,8.87 v74.1,7.91
  Bottom 0.152: U$1.19 62.24,6.66 62.59,7 73.19,7 v74.1,7.91
MOBO_SWITCHED  (via drill 0.75 pad 1)
  Top 1.27: Q22.3 v77.5,70.8 | v78.5,65.2 79.7,64 79.7,56.6 v80.9,55.4 | v89.6,44.5 90.1,44 90.1,29.8 88.1,27.8 U$5.3-
  Bottom 1.27: v77.5,70.8 77.5,66.2 v78.5,65.2 | v80.9,55.4 87.2,49.1 87.2,46.9 v89.6,44.5
MOTOR_POWER
  pour Top (no thermals): 24.3,84.2 2.5,84.2 0.6,86.1 0.6,98.7 3.1,101.2 44.3,101.2 68,77.5 68,71.9 66.7,70.6 37.9,70.6
N$1  (via drill 0.35)
  Top 1.5: v15.3,66.6 19.03,62.87 Q3.S2
  Bottom 0.8: U$2.4 12.5,68.9 12.5,68.8
  Bottom 1.5: v15.3,66.6 14.7,66.6 12.5,68.8
  pour Top (no thermals): 19.7,54.3 24.9,54.3 24.9,62.9 24.5,63.3 17.6,63.3 17.2,62.9 17.2,59 19.4,56.8 19.4,54.6
N$2  (via drill 0.35)
  Top 0.152: Q3.G 16.49,62.21 v11.9,66.8
  Bottom 0.152: U$2.5 11.97,70.05 11.34,69.41 11.34,67.36 v11.9,66.8
N$3
  Top 0.152: 12VCONVERTER.6,TRIM 71.5,56.5 71.5,60.27 73.88,62.65 R29.1
N$4
  Top 0.152: R14.1 45.38,15.12 53.9,15.12 Q4.3
N$5  (via drill 0.35)
  Top 0.152: v8.6,66.8 8.5,66.8 5.67,63.97 3.42,63.97 2.68,63.23 Q5.G
  Bottom 0.152: U$3.5 11.47,74.05 8.94,71.51 8.94,67.14 v8.6,66.8
N$6  (via drill 0.35)
  Top 0.152: R2.2 25.68,27.43 | 25.68,27.43 24.95,26.7 24.95,24.2 26.1,23.05 R4.1 | U$12.A1 29.2,20.3 31.9,20.3 32.1,20.5 32.1,23.33 29.73,25.7 28.6,25.7 v27.91,26.4 | v26.69,26.2 26.1,26.2 25.68,26.62 25.68,27.43
  Bottom 0.152: v27.91,26.4 26.89,26.4 v26.69,26.2
N$7
  Top 0.152: R1.2 26.65,29.9 27.3,29.25 27.3,25.2 | R3.1 25.95,25.1 27.2,25.1 27.3,25.2 | U$12.A0 31.48,20.88 31.8,21.2 31.8,23.2 29.6,25.4 27.5,25.4 27.3,25.2
N$8  (via drill 0.35)
  Top 0.152: Q1.1 5.22,80.7 8.04,83.53 13.54,83.53 16.26,80.8 Q2.1 18.52,80.8 21.14,83.43 24.23,83.43 26.36,81.31 26.36,67.74 v26.4,67.7 | v36.48,33.3 36.08,33.3 33.64,33.3 26.1,40.84 v26.1,63.6 | R14.2 42.15,17.7 R15.1 39.35,19.4 39.35,30.35 v39.3,30.4
  Bottom 0.152: v26.4,67.7 26.4,67.6 26.1,67.3 v26.1,63.6 | v36.48,33.3 39.3,30.48 v39.3,30.4
N$9
  Top 0.152: R7.2 R10.2 36.95,17.2 35.7,18.45 35.7,22.4 35.27,22.82 U$12.IN3
N$10  (via drill 0.35)
  Top 0.152: U$12.IN4 34.67,21.98 33.42,21.98 v33.3,22.1
  Bottom 0.152: R9.2 R8.2 33,22.4 v33.3,22.1
N$11
  Top 0.152: PORT_LED.A 27.2,34.15 R16.1 R11.1
N$12
  Top 0.152: R17.1 R18.1 28.55,9.9 29.45,9.9 STBD_LED.A
N$13
  Top 0.152: BALANCED_LED.A 34.7,32.25 R19.2 R12.2
N$14
  Top 0.152: 5VCONVERTER.6,TRIM 73.1,27.5 73.1,24.12 R28.1
N$15
  Top 0.152: R6.2 R5.2 38.3,14.95 38.3,16.6 36.05,18.85 36.05,22.59 35.42,23.23 35.12,23.23 U$12.IN2
N$16
  Top 0.5: KILLSWITCH_LED.C 56.4,12.95 R13.1
N$17
  Top 0.152: R27.1 92.15,65.75 C13.2 95.65,64.4 R30.2
  Top 0.8: Q22.1 75.92,67.4 77.34,68.83 94.75,68.83 95.7,67.87 R30.2
N$18
  Top 0.152: Q9.3 37.7,54.4 12VCONVERTER.2,ON/OFF
N$19  (via drill 0.35)
  Top 0.152: Q10.3 35.73,54.8 37.32,53.2 37.32,52.35 37.97,51.71 v38.38,51.71 | v39.62,50.02 40.02,50.02 42.73,47.33 42.73,32.42 5VCONVERTER.2,ON/OFF
  Bottom 0.152: v38.38,51.71 39.33,50.76 39.33,50.33 v39.62,50.02
N$20
  Top 0.152: R30.1 93.57,62.65 92.46,61.54 Q7.3
N$21
  Top 0.8: R45.2 90.27,53.88 Q19.2 87.77,52.35 87.77,47.82 R25.1 R26.1
N$22
  Top 0.152: Q19.1 90.67,49.32 R45.1 91.9,48.7 Q8.3
N$23
  Top 1.5: L3.2 38.2,58.7 12VCONVERTER.1,VIN(+) 41.5,62.7 37.1,67.1 C12.+
N$24  (via drill 0.8 pad 1.1)
  Top 0.152: 27.72,42.06 27.72,41.94
  Top 1.5: L1.2 27.72,42.06 | v36.1,38.1 31.56,38.1 C4.+ 27.72,41.94
  Bottom 1.5: v36.1,38.1 40.8,38.1 5VCONVERTER.1,VIN(+)
N$25
  Top 0.152: R24.1 76.45,47.9 5V_LED.A
N$26  (via drill 0.35)
  Top 0.152: Q6.1 84.8,67.4 v85.2,67 | v87,64.8 87,64.25 86.4,63.65 R33.1 84.35,63.65 83.6,62.9 C5.2 84.7,61.4 R34.2
  Bottom 0.152: v85.2,67 87,65.2 v87,64.8
N$27
  Top 0.152: 12V_LED.A 72.2,66.55 R31.1
N$28
  Top 0.152: R32.1 76.55,17.8 3V3.A
N$29
  Top 0.152: R34.1 88.05,61.35 90.2,59.2 Q11.3
N$31  (via drill 0.35)
  Top 0.152: U$12.IN6 34.08,20.88 v33.8,20.6
  Bottom 0.152: v33.8,20.6 33.8,19.9 34.2,19.5 36.6,19.5 37.2,20.1 37.2,20.6 | 37.2,20.6 R37.1 | R38.2 36.63,23.18 36.55,23.18 36.1,22.72 36.1,21.7 37.2,20.6
N$32  (via drill 0.35)
  Top 0.152: v32.91,19.8 32.91,20.8 33.64,21.52 U$12.IN5
  Bottom 0.152: R35.2 33.15,18.1 32.91,18.34 v32.91,19.8 31.6,19.8 31.25,19.45 R36.2
PLTA_ON/OFF  (via drill 0.35)
  Top 0.152: Q8.1 93.6,46.55 93.6,29.4 73.5,9.3 v72.5,9.3 | v33.1,8.8 33.2,8.9 52.6,8.9 v53.4,8.1
  Bottom 0.152: U$1.7 31.7,3.44 31.7,7.4 v33.1,8.8 | v72.5,9.3 70.81,7.61 53.89,7.61 v53.4,8.1
PLTA_SWITCHED  (via drill 0.35)
  Top 0.152: v79.8,41.5 79.67,41.63 | 31.75,3.39 U$1.50 | v69.09,9.8 v69.1,9.79
  Top 0.5: Q19.3 82,48.82 79.67,46.49 79.67,41.63 | v81,25.6 79.3,23.9 79.3,15.9 73.5,10.1 71.8,10.1 v71.7,10 | 31.75,3.39 31.75,8.74 32.81,9.8 47.6,9.8 v69.09,9.8
  Bottom 0.5: v79.8,41.5 81,40.3 v81,25.6 | v69.1,9.79 71.49,9.79 v71.7,10
PORT_BATTERY  (via drill 0.35)
  Top 0.152: U$6.IP+1 U$6.IP+2 | v23.8,32.3 23.85,32.35 R11.2 R16.2 28,31.45 28,27.8 v29.1,26.7
  Bottom 0.152: v23.8,32.3 22.8,31.3 17.39,31.3 P2.5 | R9.1 30.8,25.05 29.15,26.7 v29.1,26.7
  pour Top (no thermals): 19.4,53.9 22.3,53.9 22.3,50.9 19.1,47.7 19.1,32.9 17.8,31.6 14.7,31.6 13.6,32.7 13.6,46.5 19.3,52.2 19.3,53.8
PORT_CURRENT  (via drill 0.35)
  Top 0.152: U$12.IN1 35.12,24.37 35.42,24.37 35.55,24.5 35.55,25.14 31.12,29.58 31.12,35.13 25.5,40.75 25.5,45 24,46.5 v23.9,46.5 | U$6.VIOUT 14.82,53.37 14.15,52.69 14.15,51.7 15.75,50.1 v16.1,50.1
  Bottom 0.152: v23.9,46.5 23.86,46.5 20.26,50.1 v16.1,50.1
SOURCE  (via drill 0.35)
  Top 0.152: Q5.S5
  Top 1.5: v10.3,66.4 Q5.S5
  Bottom 0.8: U$3.4 12,72.8 11.7,72.8
  Bottom 1.5: 11.7,72.8 10.3,71.4 v10.3,66.4
  pour Top (no thermals): 3.3,63 3.7,63.4 11,63.4 12.7,61.7 12.7,15.64 16.75,12.13 19.57,12.13 20.1,11.6 20.1,9.4 19.7,9 3.6,9 1.3,11.3 1.3,57 3.3,59
STBD_BATTERY  (via drill 0.35)
  Top 0.152: R17.2 R18.2 | R7.1 v34.1,14.3 | v31.1,13.2 27.25,13.2 R17.2 | R17.2 18.72,12.4 U$7.IP+2
  Bottom 0.152: v34.1,14.3 32.2,14.3 v31.1,13.2
  pour Top (no thermals): 13.5,29.8 14.6,30.9 17.9,30.9 19,29.8 19,15.9 19.9,15 19.9,12.8 19.7,12.6 16.68,12.6 14.3,14.8 13.5,15.6
STBD_CURRENT  (via drill 0.35)
  Top 0.152: U$12.IN0 33.18,24.77 32.49,24.09 32.49,22.85 32.51,22.84 32.51,20.39 32.21,20.1 v32.21,19 | U$7.VIOUT 24.15,13.67 30.17,13.67 v31.1,14.6
  Bottom 0.152: v32.21,19 32.21,15.71 v31.1,14.6

### Text on the board
tPlace: The Underwater Robotics Team / Center for Automotive Research | Battery Balancer